# EAGLE design uPlaits_SE_Main_Board (EAGLE 9.6.2)

## Sheet 1 of 4
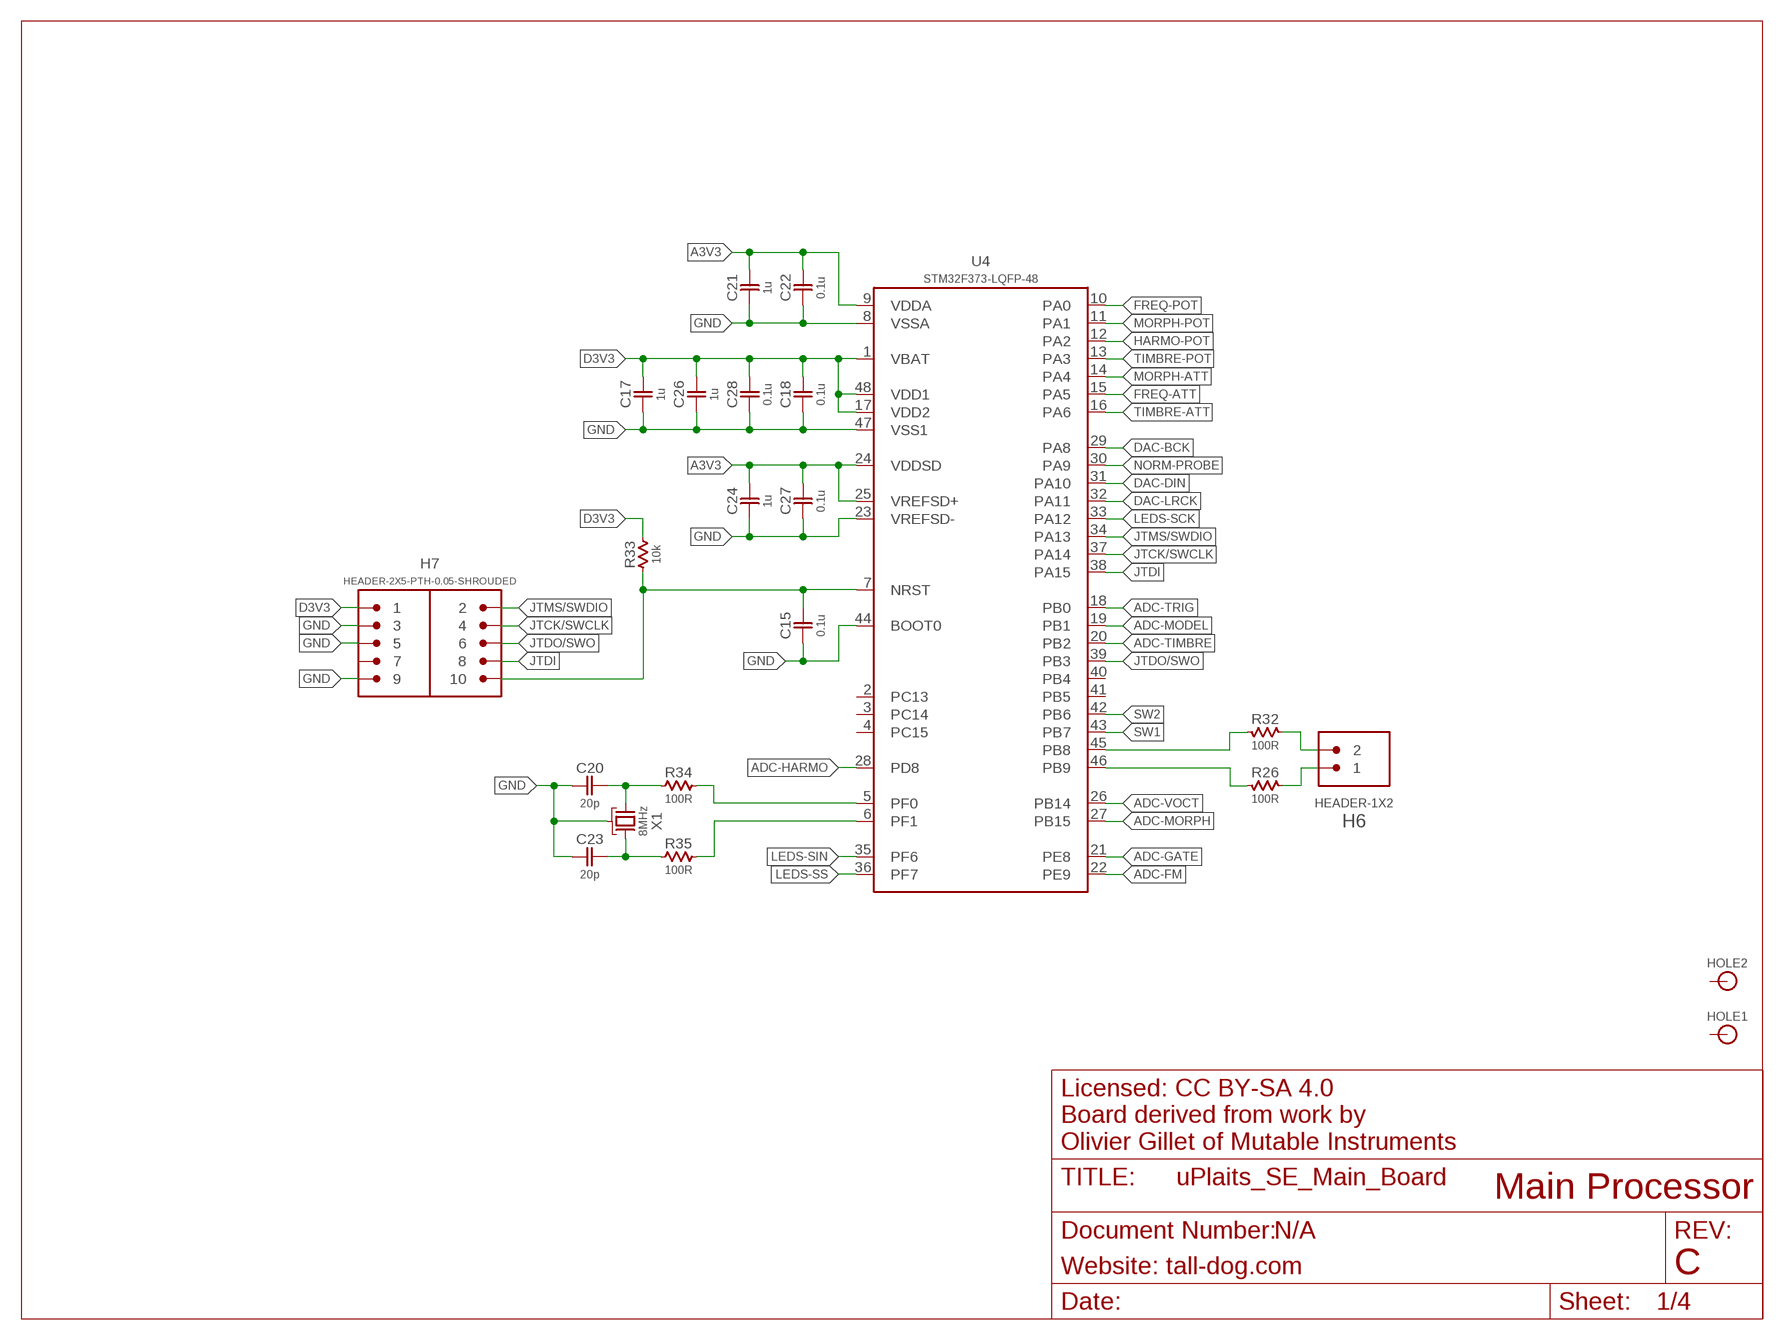
[diagram p0: schematic, sheet 1]

### Parts
C15  0.1u  CAP-NP-0603  [0603-NP]
C17  1u  CAP-NP-0603  [0603-NP]
C18  0.1u  CAP-NP-0603  [0603-NP]
C20  20p  CAP-NP-0603  [0603-NP]
C21  1u  CAP-NP-0603  [0603-NP]
C22  0.1u  CAP-NP-0603  [0603-NP]
C23  20p  CAP-NP-0603  [0603-NP]
C24  1u  CAP-NP-0603  [0603-NP]
C26  1u  CAP-NP-0603  [0603-NP]
C27  0.1u  CAP-NP-0603  [0603-NP]
C28  0.1u  CAP-NP-0603  [0603-NP]
H6  HEADER-1X2  [PTH-0.1-1X2]
H7  HEADER-2X5-PTH-0.05-SHROUDED  [PTH-0.05-2X5-SHROUDED]
HOLE1  HOLE  [HOLE-M2.5]
HOLE2  HOLE  [HOLE-M2.5]
R26  100R  RESISTOR-0603  [0603-NP]
R32  100R  RESISTOR-0603  [0603-NP]
R33  10k  RESISTOR-0603  [0603-NP]
R34  100R  RESISTOR-0603  [0603-NP]
R35  100R  RESISTOR-0603  [0603-NP]
U4  STM32F373-LQFP-48  [LQFP-48]
X1  8MHz  CRYSTAL-GND-ABMM2  [CRYSTAL-ABMM2]

### Nets
A3V3: C21.2 C22.2 C24.2 C27.2 U4.9(VDDA) U4.24(VDDSD) U4.25(VREFSD+) ; also sheet 2,3,4
ADC-FM: U4.22(PE9) ; also sheet 3
ADC-GATE: U4.21(PE8) ; also sheet 3
ADC-HARMO: U4.28(PD8) ; also sheet 3
ADC-MODEL: U4.19(PB1) ; also sheet 3
ADC-MORPH: U4.27(PB15) ; also sheet 3
ADC-TIMBRE: U4.20(PB2) ; also sheet 3
ADC-TRIG: U4.18(PB0) ; also sheet 3
ADC-VOCT: U4.26(PB14) ; also sheet 3
D3V3: C17.2 C18.2 C26.2 C28.2 H7.1 R33.2 U4.1(VBAT) U4.17(VDD2) U4.48(VDD1) ; also sheet 2,3,4
DAC-BCK: U4.29(PA8) ; also sheet 4
DAC-DIN: U4.31(PA10) ; also sheet 4
DAC-LRCK: U4.32(PA11) ; also sheet 4
FREQ-ATT: U4.15(PA5) ; also sheet 2
FREQ-POT: U4.10(PA0) ; also sheet 2
GND: C15.1 C17.1 C18.1 C20.1 C21.1 C22.1 C23.1 C24.1 C26.1 C27.1 C28.1 H7.3 H7.5 H7.9 U4.8(VSSA) U4.23(VREFSD-) U4.44(BOOT0) U4.47(VSS1) X1.2(G) X1.4(G) ; also sheet 2,3,4
HARMO-POT: U4.12(PA2) ; also sheet 2
JTCK/SWCLK: H7.4 U4.37(PA14)
JTDI: H7.8 U4.38(PA15)
JTDO/SWO: H7.6 U4.39(PB3)
JTMS/SWDIO: H7.2 U4.34(PA13)
LEDS-SCK: U4.33(PA12) ; also sheet 2
LEDS-SIN: U4.35(PF6) ; also sheet 2
LEDS-SS: U4.36(PF7) ; also sheet 2
MORPH-ATT: U4.14(PA4) ; also sheet 2
MORPH-POT: U4.11(PA1) ; also sheet 2
N$1: C20.2 R34.1 X1.3
N$2: C23.2 R35.1 X1.1
N$16: R34.2 U4.5(PF0)
N$17: R35.2 U4.6(PF1)
NORM-PROBE: U4.30(PA9) ; also sheet 3
RESET: C15.2 H7.10 R33.1 U4.7(NRST)
RX: H6.1 R26.1
RX1: R26.2 U4.46(PB9)
SW1: U4.43(PB7) ; also sheet 2
SW2: U4.42(PB6) ; also sheet 2
TIMBRE-ATT: U4.16(PA6) ; also sheet 2
TIMBRE-POT: U4.13(PA3) ; also sheet 2
TX: H6.2 R32.1
TX1: R32.2 U4.45(PB8)
Unconnected: H7.7 HOLE1.P$1 HOLE1.P$2 HOLE1.P$3 HOLE1.P$4 HOLE1.P$5 HOLE1.P$6 HOLE1.P$7 HOLE1.P$8 HOLE1.P$9 HOLE2.P$1 HOLE2.P$2 HOLE2.P$3 HOLE2.P$4 HOLE2.P$5 HOLE2.P$6 HOLE2.P$7 HOLE2.P$8 HOLE2.P$9 U4.2(PC13) U4.3(PC14) U4.4(PC15) U4.40(PB4) U4.41(PB5)

### Notes on the sheet
- Licensed: CC BY-SA 4.0
  Board derived from work by
  Olivier Gillet of Mutable Instruments
- Main Processor
- N/A
- Website: tall-dog.com | C

## Sheet 2 of 4
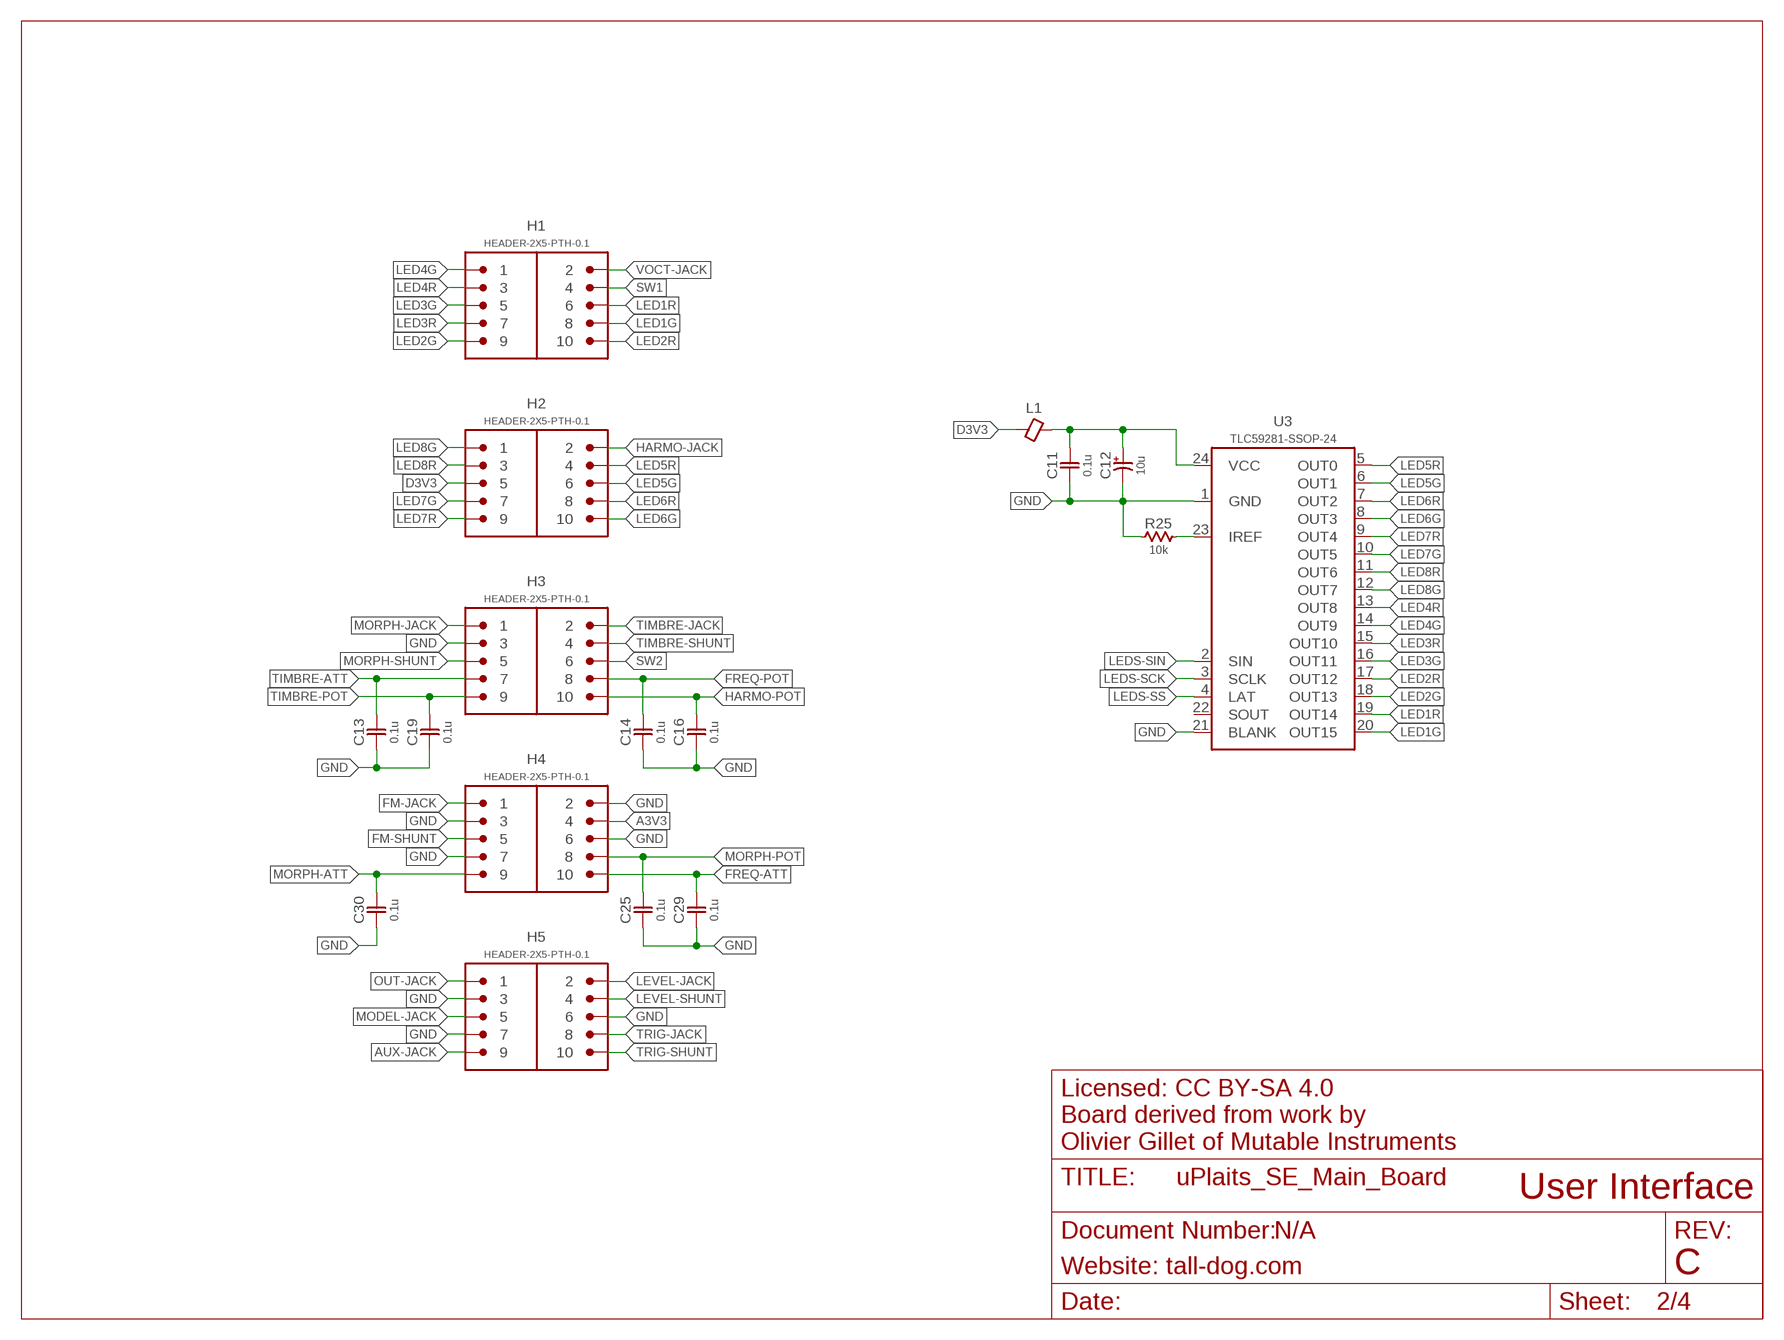
[diagram p1: schematic, sheet 2]

### Parts
C11  0.1u  CAP-NP-0603  [0603-NP]
C12  10u  CAP-P-4.3MM  [ELECTRO-SMD-4.3MM]
C13  0.1u  CAP-NP-0603  [0603-NP]
C14  0.1u  CAP-NP-0603  [0603-NP]
C16  0.1u  CAP-NP-0603  [0603-NP]
C19  0.1u  CAP-NP-0603  [0603-NP]
C25  0.1u  CAP-NP-0603  [0603-NP]
C29  0.1u  CAP-NP-0603  [0603-NP]
C30  0.1u  CAP-NP-0603  [0603-NP]
H1  HEADER-2X5-PTH-0.1  [PTH-0.1-2X5]
H2  HEADER-2X5-PTH-0.1  [PTH-0.1-2X5]
H3  HEADER-2X5-PTH-0.1  [PTH-0.1-2X5]
H4  HEADER-2X5-PTH-0.1  [PTH-0.1-2X5]
H5  HEADER-2X5-PTH-0.1  [PTH-0.1-2X5]
L1  FERRITE-BEAD-0603  [0603-NP]
R25  10k  RESISTOR-0603  [0603-NP]
U3  TLC59281-SSOP-24  [SSOP-24]

### Nets
A3V3: H4.4 ; also sheet 1,3,4
AUX-JACK: H5.9 ; also sheet 4
D3V3: H2.5 L1.1 ; also sheet 1,3,4
FM-JACK: H4.1 ; also sheet 3
FM-SHUNT: H4.5 ; also sheet 3
FREQ-ATT: C29.2 H4.10 ; also sheet 1
FREQ-POT: C14.2 H3.8 ; also sheet 1
GND: C11.1 C12.C(NEG) C13.1 C14.1 C16.1 C19.1 C25.1 C29.1 C30.1 H3.3 H4.2 H4.3 H4.6 H4.7 H5.3 H5.6 H5.7 R25.1 U3.1(GND) U3.21(BLANK) ; also sheet 1,3,4
HARMO-JACK: H2.2 ; also sheet 3
HARMO-POT: C16.2 H3.10 ; also sheet 1
IREF: R25.2 U3.23(IREF)
LED1G: H1.8 U3.20(OUT15)
LED1R: H1.6 U3.19(OUT14)
LED2G: H1.9 U3.18(OUT13)
LED2R: H1.10 U3.17(OUT12)
LED3G: H1.5 U3.16(OUT11)
LED3R: H1.7 U3.15(OUT10)
LED4G: H1.1 U3.14(OUT9)
LED4R: H1.3 U3.13(OUT8)
LED5G: H2.6 U3.6(OUT1)
LED5R: H2.4 U3.5(OUT0)
LED6G: H2.10 U3.8(OUT3)
LED6R: H2.8 U3.7(OUT2)
LED7G: H2.7 U3.10(OUT5)
LED7R: H2.9 U3.9(OUT4)
LED8G: H2.1 U3.12(OUT7)
LED8R: H2.3 U3.11(OUT6)
LEDS-SCK: U3.3(SCLK) ; also sheet 1
LEDS-SIN: U3.2(SIN) ; also sheet 1
LEDS-SS: U3.4(LAT) ; also sheet 1
LEVEL-JACK: H5.2 ; also sheet 3
LEVEL-SHUNT: H5.4 ; also sheet 3
MODEL-JACK: H5.5 ; also sheet 3
MORPH-ATT: C30.2 H4.9 ; also sheet 1
MORPH-JACK: H3.1 ; also sheet 3
MORPH-POT: C25.2 H4.8 ; also sheet 1
MORPH-SHUNT: H3.5 ; also sheet 3
N$30: C11.2 C12.A(POS) L1.2 U3.24(VCC)
OUT-JACK: H5.1 ; also sheet 4
SW1: H1.4 ; also sheet 1
SW2: H3.6 ; also sheet 1
TIMBRE-ATT: C13.2 H3.7 ; also sheet 1
TIMBRE-JACK: H3.2 ; also sheet 3
TIMBRE-POT: C19.2 H3.9 ; also sheet 1
TIMBRE-SHUNT: H3.4 ; also sheet 3
TRIG-JACK: H5.8 ; also sheet 3
TRIG-SHUNT: H5.10 ; also sheet 3
VOCT-JACK: H1.2 ; also sheet 3
Unconnected: U3.22(SOUT)

### Notes on the sheet
- Licensed: CC BY-SA 4.0
  Board derived from work by
  Olivier Gillet of Mutable Instruments
- User Interface
- N/A
- Website: tall-dog.com | C

## Sheet 3 of 4
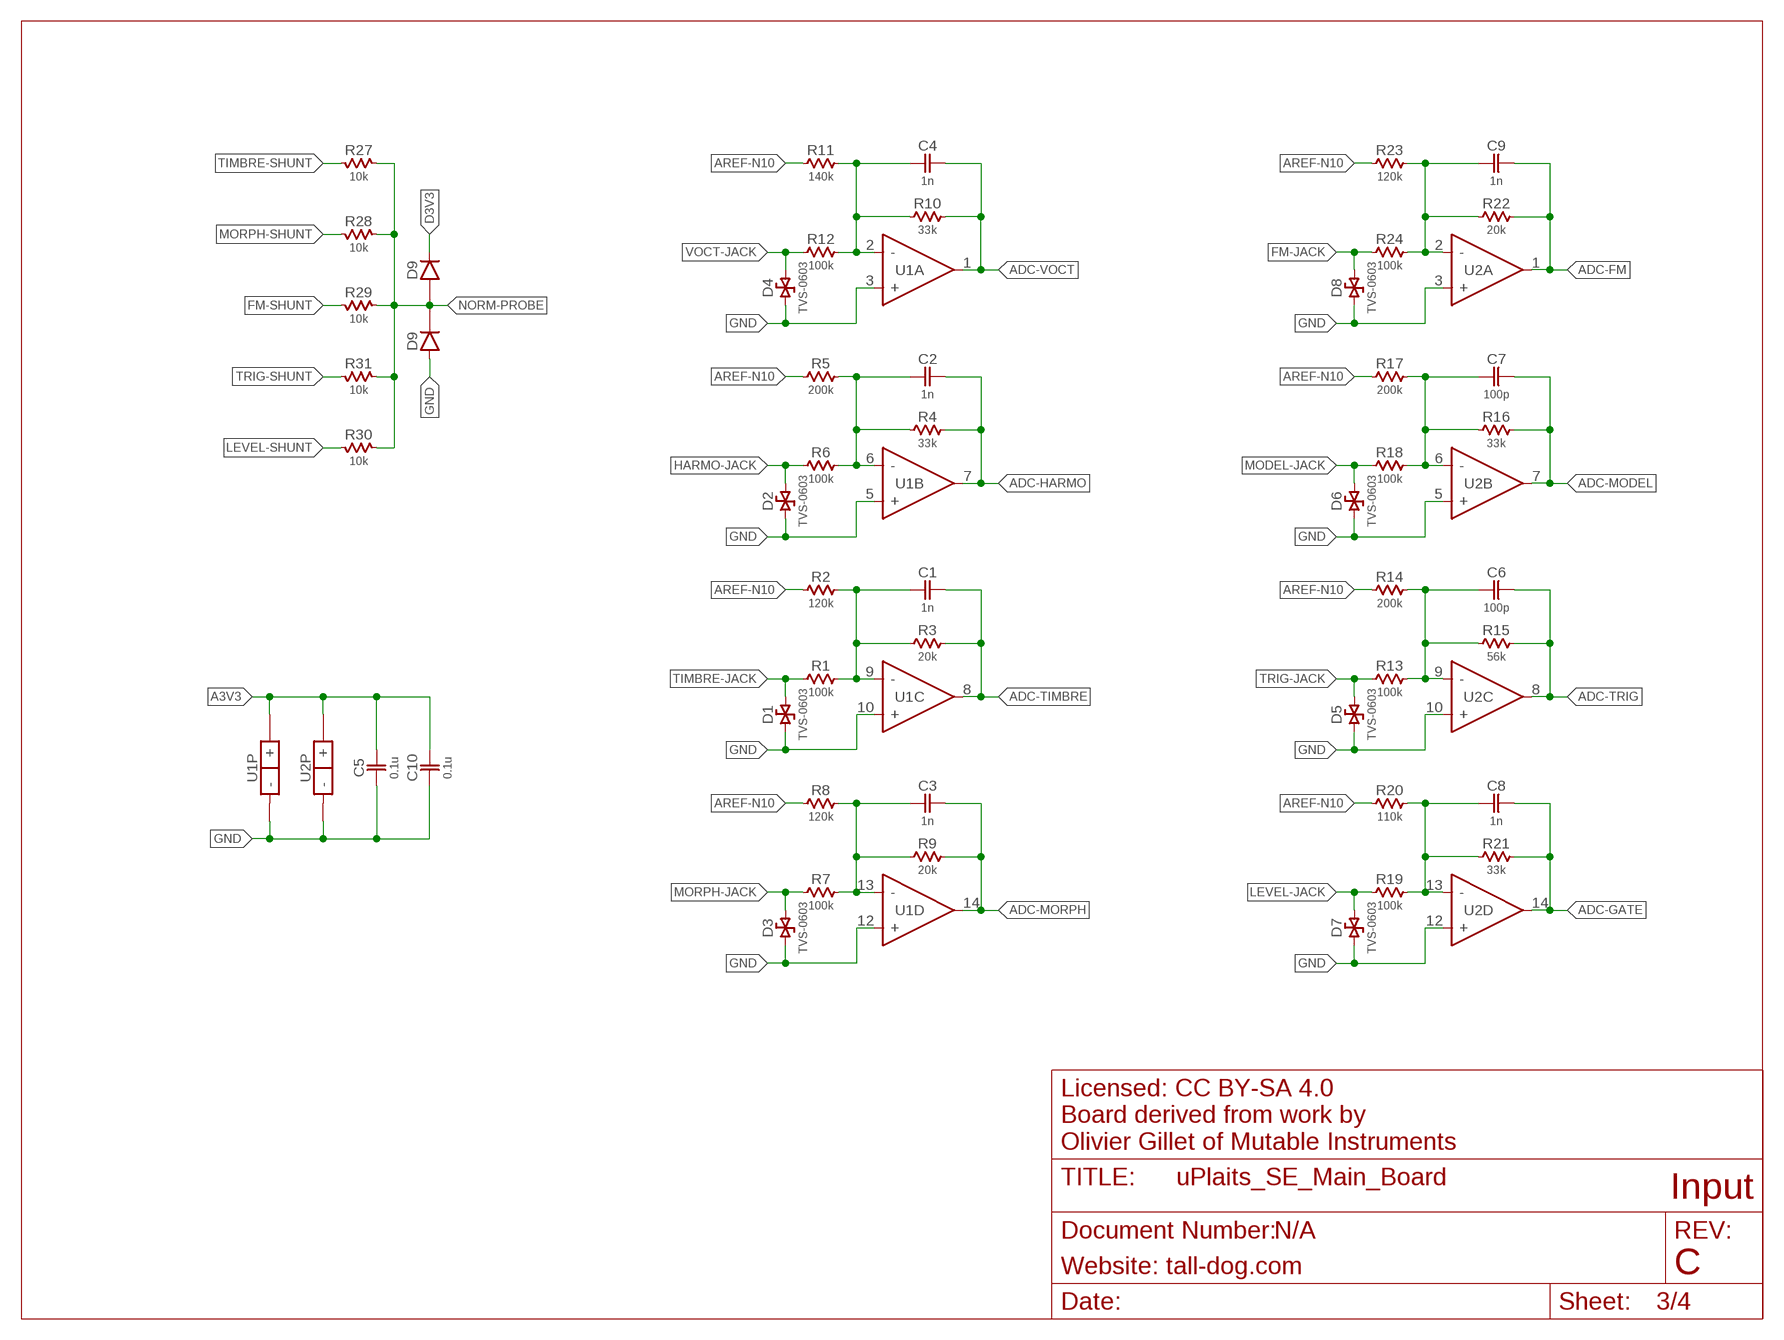
[diagram p2: schematic, sheet 3]

### Parts
C1  1n  CAP-NP-0603  [0603-NP]
C2  1n  CAP-NP-0603  [0603-NP]
C3  1n  CAP-NP-0603  [0603-NP]
C4  1n  CAP-NP-0603  [0603-NP]
C5  0.1u  CAP-NP-0603  [0603-NP]
C6  100p  CAP-NP-0603  [0603-NP]
C7  100p  CAP-NP-0603  [0603-NP]
C8  1n  CAP-NP-0603  [0603-NP]
C9  1n  CAP-NP-0603  [0603-NP]
C10  0.1u  CAP-NP-0603  [0603-NP]
D1  TVS-0603  [0603-NP]
D2  TVS-0603  [0603-NP]
D3  TVS-0603  [0603-NP]
D4  TVS-0603  [0603-NP]
D5  TVS-0603  [0603-NP]
D6  TVS-0603  [0603-NP]
D7  TVS-0603  [0603-NP]
D8  TVS-0603  [0603-NP]
D9  DIODE-DUAL-SOT-23  [SOT-23-3]
R1  100k  RESISTOR-0603  [0603-NP]
R2  120k  RESISTOR-0603  [0603-NP]
R3  20k  RESISTOR-0603  [0603-NP]
R4  33k  RESISTOR-0603  [0603-NP]
R5  200k  RESISTOR-0603  [0603-NP]
R6  100k  RESISTOR-0603  [0603-NP]
R7  100k  RESISTOR-0603  [0603-NP]
R8  120k  RESISTOR-0603  [0603-NP]
R9  20k  RESISTOR-0603  [0603-NP]
R10  33k  RESISTOR-0603  [0603-NP]
R11  140k  RESISTOR-0603  [0603-NP]
R12  100k  RESISTOR-0603  [0603-NP]
R13  100k  RESISTOR-0603  [0603-NP]
R14  200k  RESISTOR-0603  [0603-NP]
R15  56k  RESISTOR-0603  [0603-NP]
R16  33k  RESISTOR-0603  [0603-NP]
R17  200k  RESISTOR-0603  [0603-NP]
R18  100k  RESISTOR-0603  [0603-NP]
R19  100k  RESISTOR-0603  [0603-NP]
R20  110k  RESISTOR-0603  [0603-NP]
R21  33k  RESISTOR-0603  [0603-NP]
R22  20k  RESISTOR-0603  [0603-NP]
R23  120k  RESISTOR-0603  [0603-NP]
R24  100k  RESISTOR-0603  [0603-NP]
R27  10k  RESISTOR-0603  [0603-NP]
R28  10k  RESISTOR-0603  [0603-NP]
R29  10k  RESISTOR-0603  [0603-NP]
R30  10k  RESISTOR-0603  [0603-NP]
R31  10k  RESISTOR-0603  [0603-NP]
U1  MCP6004-TSSOP-14  [TSSOP-14]
U2  MCP6004-TSSOP-14  [TSSOP-14]

### Nets
A3V3: C5.2 C10.2 U1.4(P:+) U2.4(P:+) ; also sheet 1,2,4
ADC-FM: C9.2 R22.2 U2.1(A:OUT) ; also sheet 1
ADC-GATE: C8.2 R21.2 U2.14(D:OUT) ; also sheet 1
ADC-HARMO: C2.2 R4.2 U1.7(B:OUT) ; also sheet 1
ADC-MODEL: C7.2 R16.2 U2.7(B:OUT) ; also sheet 1
ADC-MORPH: C3.2 R9.2 U1.14(D:OUT) ; also sheet 1
ADC-TIMBRE: C1.2 R3.2 U1.8(C:OUT) ; also sheet 1
ADC-TRIG: C6.2 R15.2 U2.8(C:OUT) ; also sheet 1
ADC-VOCT: C4.2 R10.2 U1.1(A:OUT) ; also sheet 1
AREF-N10: R2.1 R5.1 R8.1 R11.1 R14.1 R17.1 R20.1 R23.1 ; also sheet 4
D3V3: D9.2(C2) ; also sheet 1,2,4
FM-JACK: D8.2 R24.1 ; also sheet 2
FM-SHUNT: R29.2 ; also sheet 2
GND: C5.1 C10.1 D1.1 D2.1 D3.1 D4.1 D5.1 D6.1 D7.1 D8.1 D9.1(A1) U1.3(A:+) U1.5(B:+) U1.10(C:+) U1.11(P:-) U1.12(D:+) U2.3(A:+) U2.5(B:+) U2.10(C:+) U2.11(P:-) U2.12(D:+) ; also sheet 1,2,4
HARMO-JACK: D2.2 R6.1 ; also sheet 2
LEVEL-JACK: D7.2 R19.1 ; also sheet 2
LEVEL-SHUNT: R30.2 ; also sheet 2
MODEL-JACK: D6.2 R18.1 ; also sheet 2
MORPH-JACK: D3.2 R7.1 ; also sheet 2
MORPH-SHUNT: R28.2 ; also sheet 2
N$24: C4.1 R10.1 R11.2 R12.2 U1.2(A:-)
N$26: C2.1 R4.1 R5.2 R6.2 U1.6(B:-)
N$31: C9.1 R22.1 R23.2 R24.2 U2.2(A:-)
N$32: C1.1 R1.2 R2.2 R3.1 U1.9(C:-)
N$33: C3.1 R7.2 R8.2 R9.1 U1.13(D:-)
N$37: C7.1 R16.1 R17.2 R18.2 U2.6(B:-)
N$43: C6.1 R13.2 R14.2 R15.1 U2.9(C:-)
N$45: C8.1 R19.2 R20.2 R21.1 U2.13(D:-)
NORM-PROBE: D9.3(C1/A2) R27.1 R28.1 R29.1 R30.1 R31.1 ; also sheet 1
TIMBRE-JACK: D1.2 R1.1 ; also sheet 2
TIMBRE-SHUNT: R27.2 ; also sheet 2
TRIG-JACK: D5.2 R13.1 ; also sheet 2
TRIG-SHUNT: R31.2 ; also sheet 2
VOCT-JACK: D4.2 R12.1 ; also sheet 2

### Notes on the sheet
- Licensed: CC BY-SA 4.0
  Board derived from work by
  Olivier Gillet of Mutable Instruments
- Input
- N/A
- Website: tall-dog.com | C

## Sheet 4 of 4
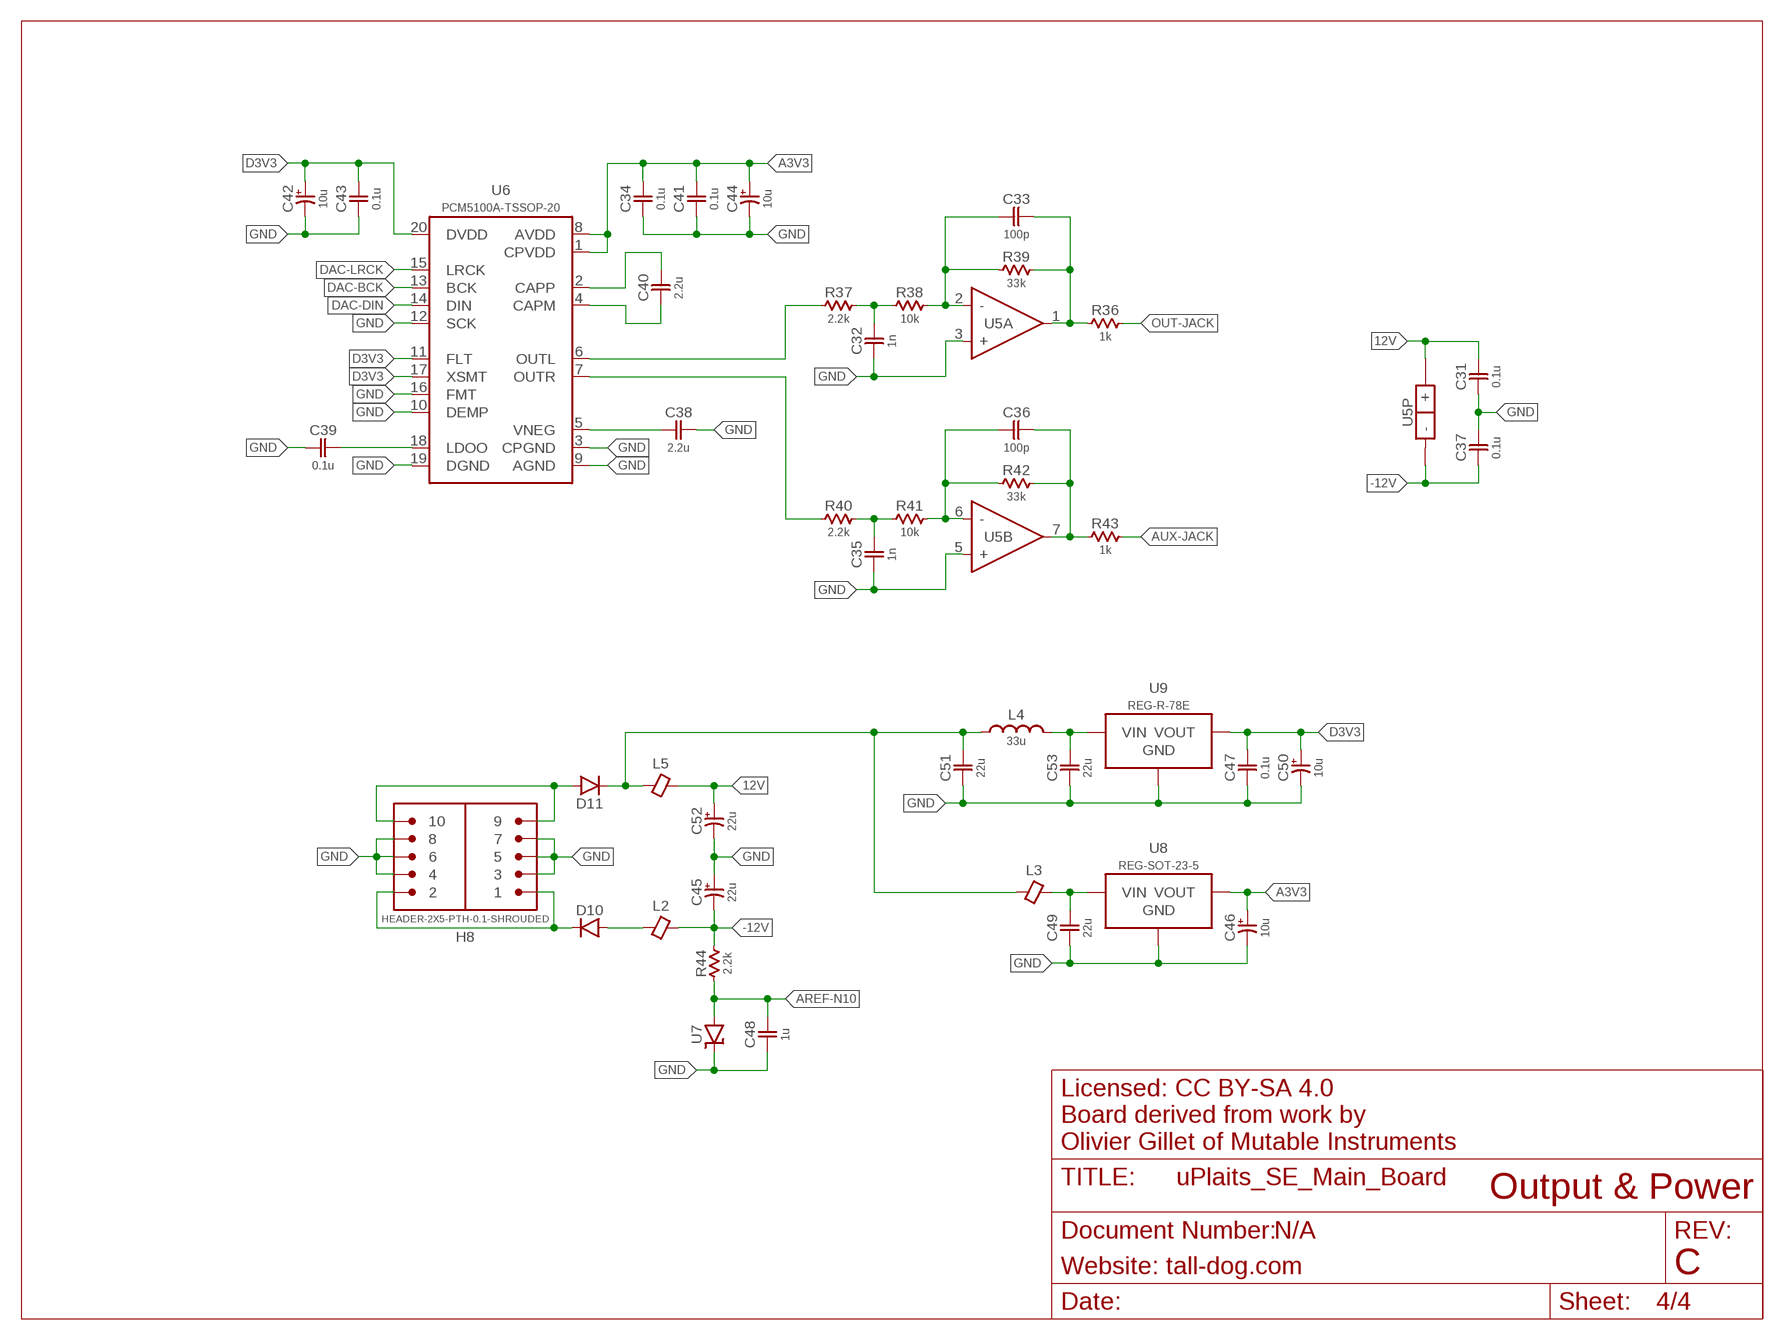
[diagram p3: schematic, sheet 4]

### Parts
C31  0.1u  CAP-NP-0603  [0603-NP]
C32  1n  CAP-NP-0603  [0603-NP]
C33  100p  CAP-NP-0603  [0603-NP]
C34  0.1u  CAP-NP-0603  [0603-NP]
C35  1n  CAP-NP-0603  [0603-NP]
C36  100p  CAP-NP-0603  [0603-NP]
C37  0.1u  CAP-NP-0603  [0603-NP]
C38  2.2u  CAP-NP-0805  [0805-NP]
C39  0.1u  CAP-NP-0603  [0603-NP]
C40  2.2u  CAP-NP-0805  [0805-NP]
C41  0.1u  CAP-NP-0603  [0603-NP]
C42  10u  CAP-P-4.3MM  [ELECTRO-SMD-4.3MM]
C43  0.1u  CAP-NP-0603  [0603-NP]
C44  10u  CAP-P-4.3MM  [ELECTRO-SMD-4.3MM]
C45  22u  CAP-P-6.6MM  [ELECTRO-SMD-6.6MM]
C46  10u  CAP-P-4.3MM  [ELECTRO-SMD-4.3MM]
C47  0.1u  CAP-NP-0603  [0603-NP]
C48  1u  CAP-NP-0603  [0603-NP]
C49  22u  CAP-NP-1206  [1206-NP]
C50  10u  CAP-P-4.3MM  [ELECTRO-SMD-4.3MM]
C51  22u  CAP-NP-1206  [1206-NP]
C52  22u  CAP-P-6.6MM  [ELECTRO-SMD-6.6MM]
C53  22u  CAP-NP-1206  [1206-NP]
D10  DIODE-SOD123  [SOD-123]
D11  DIODE-SOD123  [SOD-123]
H8  HEADER-2X5-PTH-0.1-SHROUDED  [PTH-0.1-2X5-SHROUDED]
L2  FERRITE-BEAD-0603  [0603-NP]
L3  FERRITE-BEAD-0603  [0603-NP]
L4  33u  INDUCTOR-0805  [0805-NP]
L5  FERRITE-BEAD-0603  [0603-NP]
R36  1k  RESISTOR-0603  [0603-NP]
R37  2.2k  RESISTOR-0603  [0603-NP]
R38  10k  RESISTOR-0603  [0603-NP]
R39  33k  RESISTOR-0603  [0603-NP]
R40  2.2k  RESISTOR-0603  [0603-NP]
R41  10k  RESISTOR-0603  [0603-NP]
R42  33k  RESISTOR-0603  [0603-NP]
R43  1k  RESISTOR-0603  [0603-NP]
R44  2.2k  RESISTOR-0603  [0603-NP]
U5  TL072-SO-8  [SO-8]
U6  PCM5100A-TSSOP-20  [TSSOP-20]
U7  LM4040-SOT-23  [SOT-23-3]
U8  REG-SOT-23-5  [SOT-23-5]
U9  REG-R-78E  [R-78E]

### Nets
12V: C31.2 C52.A(POS) L5.2 U5.8(P:+)
12V-IN: D11.A H8.9 H8.10
-12V: C37.1 C45.C(NEG) L2.2 R44.2 U5.4(P:-)
-12V-IN: D10.C H8.1 H8.2
A3V3: C34.2 C41.2 C44.A(POS) C46.A(POS) U6.1(CPVDD) U6.8(AVDD) U8.5(VOUT) ; also sheet 1,2,3
AREF-N10: C48.2 R44.1 U7.2(A) ; also sheet 3
AUX-JACK: R43.2 ; also sheet 2
D3V3: C42.A(POS) C43.2 C47.2 C50.A(POS) U6.11(FLT) U6.17(XSMT) U6.20(DVDD) U9.3(VOUT) ; also sheet 1,2,3
DAC-BCK: U6.13(BCK) ; also sheet 1
DAC-DIN: U6.14(DIN) ; also sheet 1
DAC-LRCK: U6.15(LRCK) ; also sheet 1
GND: C31.1 C32.1 C34.1 C35.1 C37.2 C38.2 C39.1 C41.1 C42.C(NEG) C43.1 C44.C(NEG) C45.A(POS) C46.C(NEG) C47.1 C48.1 C49.1 C50.C(NEG) C51.1 C52.C(NEG) C53.1 H8.3 H8.4 H8.5 H8.6 H8.7 H8.8 U5.3(A:+) U5.5(B:+) U6.3(CPGND) U6.9(AGND) U6.10(DEMP) U6.12(SCK) U6.16(FMT) U6.19(DGND) U7.1(C) U8.2(GND) U9.2(GND) ; also sheet 1,2,3
N$42: C32.2 R37.2 R38.1
N$44: C35.2 R40.2 R41.1
N$47: C33.1 R38.2 R39.1 U5.2(A:-)
N$48: C36.1 R41.2 R42.1 U5.6(B:-)
N$51: C40.2 U6.2(CAPP)
N$52: C40.1 U6.4(CAPM)
N$53: R37.1 U6.6(OUTL)
N$54: R40.1 U6.7(OUTR)
N$55: C38.1 U6.5(VNEG)
N$56: D10.A L2.1
N$57: C51.2 D11.C L3.1 L4.1 L5.1
N$58: C36.2 R42.2 R43.1 U5.7(B:OUT)
N$59: C33.2 R36.1 R39.2 U5.1(A:OUT)
N$61: C53.2 L4.2 U9.1(VIN)
N$62: C49.2 L3.2 U8.1(VIN) U8.3(VIN)
N$63: C39.2 U6.18(LDOO)
OUT-JACK: R36.2 ; also sheet 2

### Notes on the sheet
- Licensed: CC BY-SA 4.0
  Board derived from work by
  Olivier Gillet of Mutable Instruments
- Output & Power
- N/A
- Website: tall-dog.com | C

## Library data of the parts
C1-C11 C13-C41 C43 C47-C49 C51 C53 = uPlaits_SE_Library:CAP-NP
C12 C42 C44-C46 C50 C52 = uPlaits_SE_Library:CAP-P
D1-D8 = uPlaits_SE_Library:TVS
D9 = uPlaits_SE_Library:DIODE-DUAL
D10 D11 = uPlaits_SE_Library:DIODE
H1-H5 H7 H8 = uPlaits_SE_Library:HEADER-2X5
H6 = uPlaits_SE_Library:HEADER-1X2
HOLE1 HOLE2 = uPlaits_SE_Library:HOLE
L1-L3 L5 = uPlaits_SE_Library:FERRITE-BEAD
L4 = uPlaits_SE_Library:INDUCTOR
R1-R44 = uPlaits_SE_Library:RESISTOR
U1 U2 = uPlaits_SE_Library:MCP6004
U3 = uPlaits_SE_Library:TLC59281
U4 = uPlaits_SE_Library:STM32F373
U5 = uPlaits_SE_Library:TL072
U6 = uPlaits_SE_Library:PCM5100A
U7 = uPlaits_SE_Library:LM4040
U8 U9 = uPlaits_SE_Library:REG
X1 = uPlaits_SE_Library:CRYSTAL-GND

## Board
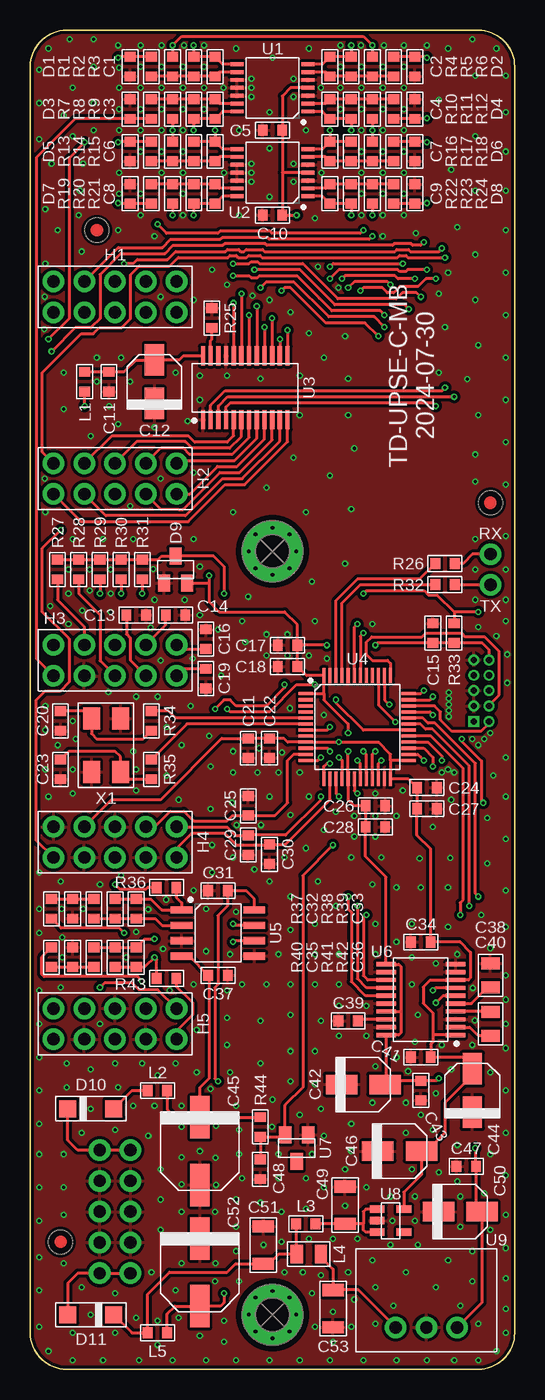
[diagram p4: board, top side]
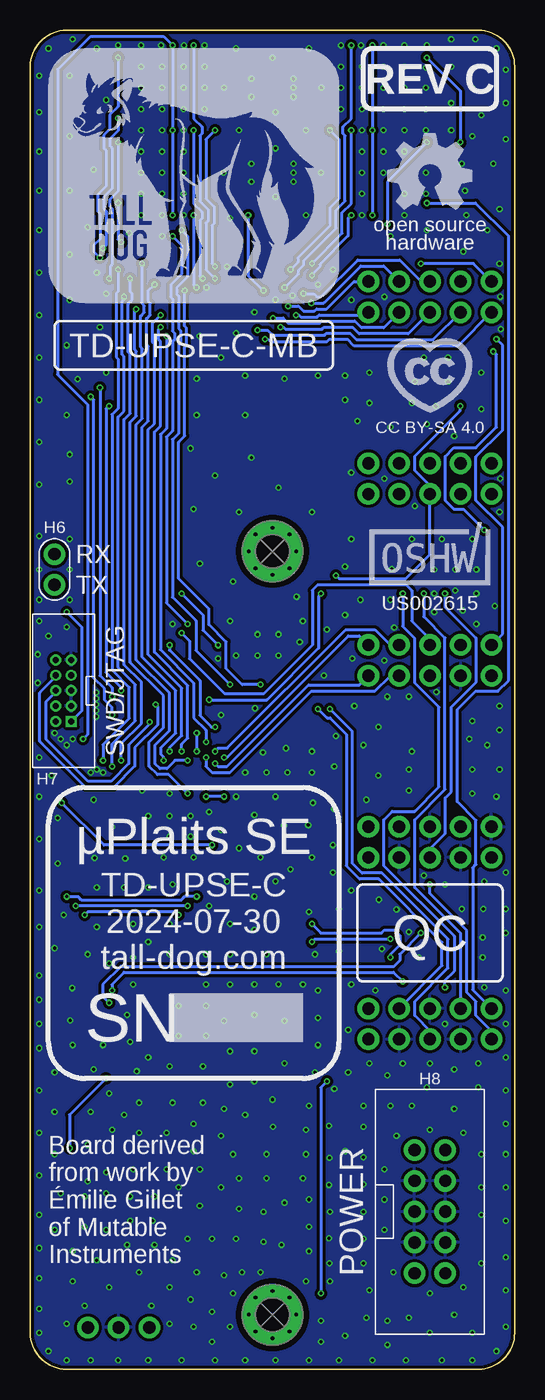
[diagram p5: board, bottom side, seen from below]

Size 40 x 110.5 mm. Coordinates in mm from the lower left corner, seen from the top.
Outline: 3,0 37,0 arc90 40,3 40,107.5 arc90 37,110.5 3,110.5 arc90 0,107.5 0,3 arc90 3,0
Copper layers (1*16): Top 0.035mm / dielectric 1.5mm / Bottom 0.035mm
Design rules "default *": minimum track width 0.25mm, minimum drill 0.25mm, track to track 0.25mm, track to pad 0.25mm, pad to pad 0.25mm, via to via 0.25mm, smd to smd 0.25mm, copper to edge 0.25mm, drill to drill 0.25mm, minimum pad ring 5mil, minimum via ring 5mil, stop-mask expansion 0mil, vias tented up to drill 0.35mm, thermal gap 0.25mm

### Footprints (pad centres in the part's own frame; a part is rotated, then mirrored left to right if it is on the bottom)
0603-NP = smd 0.81 x 0.93: 1 -0.81,0; 2 0.81,0
ELECTRO-SMD-4.3MM = smd 2.6 x 1.6: A 1.8,0; C -1.8,0
0805-NP = smd 1 x 1.5: 1 -1,0; 2 1,0
ELECTRO-SMD-6.6MM = smd 3.5 x 1.6: A 2.8,0; C -2.8,0
1206-NP = smd 1 x 1.77: 1 -1.535,0; 2 1.535,0
SOT-23-3 = smd 1 x 1.4: 1 -0.95,-1.1; 2 0.95,-1.1; 3 0,1.1
SOD-123 = smd 1.4 x 1.4: A 1.9,0; C -1.9,0
PTH-0.1-2X5 = drill 1.016 pad 1.778: 1 -5.08,-1.27; 2 -5.08,1.27; 3 -2.54,-1.27; 4 -2.54,1.27; 5 0,-1.27; 6 0,1.27; 7 2.54,-1.27; 8 2.54,1.27; 9 5.08,-1.27; 10 5.08,1.27
PTH-0.1-1X2 = drill 1.016 pad 1.778: 1 -1.27,0; 2 1.27,0
PTH-0.05-2X5-SHROUDED = drill 0.5 pad 0.9 square: 1 -0.635,2.54 | drill 0.5 pad 0.9: 2 0.635,2.54; 3 -0.635,1.27; 4 0.635,1.27; 5 -0.635,0; 6 0.635,0; 7 -0.635,-1.27; 8 0.635,-1.27; 9 -0.635,-2.54; 10 0.635,-2.54
PTH-0.1-2X5-SHROUDED = drill 1.016 pad 1.778: 1 -1.27,5.08; 2 1.27,5.08; 3 -1.27,2.54; 4 1.27,2.54; 5 -1.27,0; 6 1.27,0; 7 -1.27,-2.54; 8 1.27,-2.54; 9 -1.27,-5.08; 10 1.27,-5.08
HOLE-M2.5 = drill 2.75 pad 5: P$1 0,0 | drill 0.3: P$2 0,1.95; P$3 0,-1.95; P$4 -1.95,0; P$5 1.95,0; P$6 1.4,1.4; P$7 -1.4,1.4; P$8 -1.4,-1.4; P$9 1.4,-1.4
TSSOP-14 = smd 0.32 x 1.05: 1 -1.95,-2.925; 2 -1.3,-2.925; 3 -0.65,-2.925; 4 0,-2.925; 5 0.65,-2.925; 6 1.3,-2.925; 7 1.95,-2.925; 8 1.95,2.925; 9 1.3,2.925; 10 0.65,2.925; 11 0,2.925; 12 -0.65,2.925; 13 -1.3,2.925; 14 -1.95,2.925
SSOP-24 = smd 1.6 x 0.35: 1 -2.629,3.493; 2 -2.629,2.857; 3 -2.629,2.223; 4 -2.629,1.587; 5 -2.629,0.953; 6 -2.629,0.318; 7 -2.629,-0.318; 8 -2.629,-0.953; 9 -2.629,-1.587; 10 -2.629,-2.223; 11 -2.629,-2.857; 12 -2.629,-3.493; 13 2.629,-3.493; 14 2.629,-2.857; 15 2.629,-2.223; 16 2.629,-1.587; 17 2.629,-0.953; 18 2.629,-0.318; 19 2.629,0.318; 20 2.629,0.953; 21 2.629,1.587; 22 2.629,2.223; 23 2.629,2.857; 24 2.629,3.493
LQFP-48 = smd 0.25 x 1.2: 1 -2.75,-4.25; 2 -2.25,-4.25; 3 -1.75,-4.25; 4 -1.25,-4.25; 5 -0.75,-4.25; 6 -0.25,-4.25; 7 0.25,-4.25; 8 0.75,-4.25; 9 1.25,-4.25; 10 1.75,-4.25; 11 2.25,-4.25; 12 2.75,-4.25; 25 2.75,4.25; 26 2.25,4.25; 27 1.75,4.25; 28 1.25,4.25; 29 0.75,4.25; 30 0.25,4.25; 31 -0.25,4.25; 32 -0.75,4.25; 33 -1.25,4.25; 34 -1.75,4.25; 35 -2.25,4.25; 36 -2.75,4.25 | smd 1.2 x 0.25: 13 4.25,-2.75; 14 4.25,-2.25; 15 4.25,-1.75; 16 4.25,-1.25; 17 4.25,-0.75; 18 4.25,-0.25; 19 4.25,0.25; 20 4.25,0.75; 21 4.25,1.25; 22 4.25,1.75; 23 4.25,2.25; 24 4.25,2.75; 37 -4.25,2.75; 38 -4.25,2.25; 39 -4.25,1.75; 40 -4.25,1.25; 41 -4.25,0.75; 42 -4.25,0.25; 43 -4.25,-0.25; 44 -4.25,-0.75; 45 -4.25,-1.25; 46 -4.25,-1.75; 47 -4.25,-2.25; 48 -4.25,-2.75
SO-8 = smd 0.6 x 1.8: 1 -1.905,-3; 2 -0.635,-3; 3 0.635,-3; 4 1.905,-3; 5 1.905,3; 6 0.635,3; 7 -0.635,3; 8 -1.905,3
TSSOP-20 = smd 1.6 x 0.35: 1 -2.872,2.925; 2 -2.872,2.275; 3 -2.872,1.625; 4 -2.872,0.975; 5 -2.872,0.325; 6 -2.872,-0.325; 7 -2.872,-0.975; 8 -2.872,-1.625; 9 -2.872,-2.275; 10 -2.872,-2.925; 11 2.872,-2.925; 12 2.872,-2.275; 13 2.872,-1.625; 14 2.872,-0.975; 15 2.872,-0.325; 16 2.872,0.325; 17 2.872,0.975; 18 2.872,1.625; 19 2.872,2.275; 20 2.872,2.925
SOT-23-5 = smd 0.62 x 1.22: 1 -0.95,-1.1; 2 0,-1.1; 3 0.95,-1.1; 4 0.95,1.1; 5 -0.95,1.1
R-78E = drill 1.016 pad 1.778: 1 -2.54,0; 2 0,0; 3 2.54,0
CRYSTAL-ABMM2 = smd 1.8 x 1.4: 1 -2.2,-1.2; 2 2.2,-1.2; 3 2.2,1.2; 4 -2.2,1.2

### Placement (x,y rotation side)
C1  15.25,107.5 90 top
C2  24.75,107.5 90 top
C3  15.25,104 270 top
C4  24.75,104 270 top
C5  20,102.25 0 top
C6  15.25,100.5 90 top
C7  24.75,100.5 90 top
C8  15.25,97 270 top
C9  24.75,97 270 top
C10  20,95.25 0 top
C11  6.5,81.5 90 top
C12  10.25,81.5 90 top
C13  8.75,62.25 180 top
C14  12,62.25 180 top
C15  33.25,60.75 270 top
C16  14.5,60.25 270 top
C17  21.25,59.75 0 top
C18  21.25,58 0 top
C19  14.5,57 90 top
C20  2.5,53.5 90 top
C21  18,51.25 90 top
C22  19.75,51.25 90 top
C23  2.5,49.5 90 top
C24  32.75,48 180 top
C25  18,46.5 270 top
C26  28.5,46.5 180 top
C27  32.75,46.25 180 top
C28  28.5,44.75 180 top
C29  18,43.25 90 top
C30  19.75,42.5 90 top
C31  15.5,39.5 0 top
C32  3.5,38 90 top
C33  8.75,38 90 top
C34  32.25,35.25 0 top
C35  3.5,34 270 top
C36  8.75,34 270 top
C37  15.5,32.5 0 top
C38  38,32.5 90 top
C39  26.25,28.75 0 top
C40  38,28.5 270 top
C41  32.25,25.75 0 top
C42  27.5,23.5 0 top
C43  32.25,23 90 top
C44  36.5,23 90 top
C45  14,18 270 top
C46  30.5,18 0 top
C47  36,16.75 0 top
C48  19,16.5 90 top
C49  26,13.54 270 top
C50  35.5,13 0 top
C51  19.25,10.25 270 top
C52  14,8 270 top
C53  25,5 90 top
D1  8.25,107.5 90 top
D2  31.75,107.5 90 top
D3  8.25,104 270 top
D4  31.75,104 270 top
D5  8.25,100.5 90 top
D6  31.75,100.5 90 top
D7  8.25,97 270 top
D8  31.75,97 270 top
D9  12,66 0 top
D10  5,21.5 0 top
D11  5,4.5 180 top
H1  7,88.5 0 top
H2  7,73.5 0 top
H3  7,58.5 0 top
H4  7,43.5 0 top
H5  7,28.5 0 top
H6  38,66 270 bottom
H7  37.25,56 180 bottom
H8  7,13 0 bottom
HOLE1  20,67.5 0 top
HOLE2  20,4.5 0 top
L1  4.5,81.5 90 top
L2  10.5,23 0 top
L3  22.75,12 0 top
L4  23,9.5 0 top
L5  10.5,3 0 top
R1  10,107.5 270 top
R2  11.75,107.5 270 top
R3  13.5,107.5 90 top
R4  26.5,107.5 90 top
R5  28.25,107.5 270 top
R6  30,107.5 270 top
R7  10,104 90 top
R8  11.75,104 90 top
R9  13.5,104 270 top
R10  26.5,104 270 top
R11  28.25,104 90 top
R12  30,104 90 top
R13  10,100.5 270 top
R14  11.75,100.5 270 top
R15  13.5,100.5 90 top
R16  26.5,100.5 90 top
R17  28.25,100.5 270 top
R18  30,100.5 270 top
R19  10,97 90 top
R20  11.75,97 90 top
R21  13.5,97 270 top
R22  26.5,97 270 top
R23  28.25,97 90 top
R24  30,97 90 top
R25  15,86.75 270 top
R26  34.25,66.5 180 top
R27  2.25,66 270 top
R28  4,66 270 top
R29  5.75,66 270 top
R30  7.5,66 270 top
R31  9.25,66 270 top
R32  34.25,64.75 180 top
R33  35,60.75 90 top
R34  10,53.5 90 top
R35  10,49.5 90 top
R36  11.25,39.75 180 top
R37  1.75,38 90 top
R38  5.25,38 270 top
R39  7,38 90 top
R40  1.75,34 270 top
R41  5.25,34 90 top
R42  7,34 270 top
R43  11.25,32.25 0 top
R44  19,20 90 top
U1  20,105.75 90 top
U2  20,98.75 90 top
U3  17.75,81 90 top
U4  27,53 270 top
U5  15.5,36 270 top
U6  32.25,30.5 180 top
U7  22,18.25 180 top
U8  29.75,12.25 270 top
U9  32.71,3.45 0 top
U$1  [LOGO-TD]  26.5,98.5 0 bottom
U$6  [FIDUCIAL]  5.5,94 0 top
U$7  [FIDUCIAL]  38,71.5 0 top
U$8  [FIDUCIAL]  2.5,10.5 0 top
U$9  [LOGO-CC]  7,82 0 bottom
U$10  [LOGO-OSH]  7,98.5 0 bottom
U$11  [LOGO-OSHW]  7,67 0 bottom
U$12  [LOGO-PN]  26.5,84.5 0 bottom
U$13  [LOGO-QC]  7,36 0 bottom
U$14  [LOGO-REV]  7,106.5 0 bottom
U$15  [LOGO-SN]  26.5,37 0 bottom
X1  6.25,51.5 90 top

### Tracks (layer width: path | path; a pad name or v marks a point on that pad's centre or on a via)
12V  (via drill 0.25)
  Top 0.25: U5.8 18.5,38.81 17.81,39.5 C31.2 16.31,38.25 15.5,37.44 15.5,31.75 15.25,31.5 15.25,24 v15.5,23.75 | v16,6.25 16,5.5 15.7,5.2 C52.A 11.95,5.2 11.31,4.56 L5.2
  Bottom 0.25: v15.5,23.75 16,23.25 v16,6.25
12V-IN
  Top 0.25: D11.A 3.1,7.1 3.92,7.92 H8.10 H8.9
-12V
  Top 0.25: C45.C R44.2 | U5.4 13.1,34.09 C37.1 14.75,32.44 14.75,24 14,23.25 C45.C | L2.2 11.31,21.44 11.95,20.8 C45.C
-12V-IN
  Top 0.25: H8.1 H8.2 3.92,18.08 3.1,18.9 D10.C
A3V3  (via drill 0.25)
  Top 0.25: U8.5 30.85,14.6 32.3,16.05 C46.A 32.75,18 34.25,19.5 34.25,22 36.5,24.25 C44.A 36.5,25.75 C41.2 33.06,26.81 33.25,27 33.25,27.57 | 33.25,27.57 33.25,29.4 32.45,30.2 32.45,31.55 33.02,32.12 U6.8 36.17,32.12 36.35,32.3 36.35,34.4 35.5,35.25 C34.2 33.06,42.94 31.94,44.06 C27.2 C24.2 31.19,48.75 U4.24 29.75,50.25 | U6.1 33.25,27.57 | U1.4 21.5,105.75 20.81,105.06 C5.2 20.81,98.75 | U2.4 20.81,98.75 | 20.81,98.75 C10.2 v22,95.25 | H4.4 6.69,47 10.75,47 15.81,52.06 C21.2 C22.2 20.94,52.06 21.25,51.75 U4.9 v25.5,51.75 28.75,51.75 29.75,50.75 29.75,50.25 | U4.25 29.75,50.25 | v28.75,85.25 27.65,86.35 24.4,86.35 21.5,89.25 21,89.25 v20.75,89
  Bottom 0.25: v25.5,51.75 25.5,52.75 26.5,53.75 26.5,56.63 29.25,59.38 29.25,77.14 28.75,77.64 v28.75,85.25 | v22,95.25 22,90.25 v20.75,89
ADC-FM  (via drill 0.25)
  Top 0.25: U2.1 24.14,96.8 C9.2 R22.2 v26.5,95.25 | U4.22 28.75,50 v29,50.25 | v29.75,89.5 29.5,89.75 26.75,89.75 v26.25,89.25
  Bottom 0.25: v26.5,95.25 26.5,89.5 v26.25,89.25 | v29,50.25 29,50.54 29.18,50.72 29.18,51.32 28,52.5 28,56.01 30.75,58.76 30.75,77.76 30.25,78.26 30.25,84.41 30.4,84.57 30.4,86.72 30.1,87.02 30.1,87.98 30.25,88.13 30.25,89 v29.75,89.5
ADC-GATE  (via drill 0.25)
  Top 0.25: U2.14 15.86,96.8 C8.2 R21.2 v13.5,95.25 | U4.21 28.25,50.75 v28.5,51 | v29.25,87 28.9,87.35 24.91,87.35 23.88,88.38 22.03,90.25 18.92,90.25 18.77,90.1 18.23,90.1 18.08,90.25 v16.75,90.25
  Bottom 0.25: v28.5,51 28.5,51.29 27.5,52.29 27.5,56.21 30.25,58.96 30.25,77.55 29.75,78.05 29.75,84.62 29.9,84.77 29.9,86.35 v29.25,87 | v13.5,95.25 13.75,95 13.75,93.54 16.1,91.19 16.1,90.98 16.75,90.33 v16.75,90.25
ADC-HARMO  (via drill 0.25)
  Top 0.25: U1.7 24.14,107.7 C2.2 R4.2 v26.5,109.25 | U4.28 32.85,51.75 34,50.6 v34,50.25 | v32.75,90.75 31.17,90.75 31.02,90.6 30.48,90.6 30.33,90.75 25.5,90.75 v24.75,90
  Bottom 0.25: v26.5,109.25 26.5,103.21 25.82,102.53 25.82,101.97 26,101.79 26,96.42 25.32,95.74 25.32,94.76 25.5,94.58 25.5,90.75 v24.75,90 | v34,50.25 34,51.54 31.82,53.72 31.82,56.28 33.25,57.71 33.25,78.79 32.75,79.29 32.75,83.38 32.9,83.53 32.9,88.77 32.75,88.92 v32.75,90.75
ADC-MODEL  (via drill 0.25)
  Top 0.25: U2.7 24.14,100.7 C7.2 | R16.2 C7.2 | v24.75,102.25 C7.2 | U4.19 27.25,50 v27,50.25 | v24.75,91 25,91.25 v30.75,91.25
  Bottom 0.25: v24.75,102.25 25.5,101.5 25.5,96.62 24.82,95.94 24.82,94.56 25,94.38 25,91.25 v24.75,91 | v27,50.25 28.04,50.25 28.72,49.57 29.28,49.57 29.68,49.97 29.68,51.53 28.5,52.71 28.5,55.8 31.25,58.55 31.25,77.96 30.75,78.46 30.75,84.21 30.9,84.36 30.9,86.93 30.6,87.23 30.6,87.77 30.75,87.92 v30.75,91.25
ADC-MORPH  (via drill 0.25)
  Top 0.25: U1.14 15.86,103.8 C3.2 R9.2 v13.5,102.25 | U4.27 32.5,51.25 33.25,50.5 v33.25,49.75 | v16.75,91.25 18.08,91.25 18.23,91.4 18.77,91.4 18.92,91.25 22.5,91.25 25.4,88.35 30.23,88.35 30.73,88.85 31.9,88.85 v32.25,88.5
  Bottom 0.25: v13.5,102.25 13.5,96.21 14.25,95.46 14.25,93.75 v16.75,91.25 | v33.25,49.75 33.25,51.59 31.32,53.51 31.32,56.49 32.75,57.91 32.75,78.58 32.25,79.08 32.25,83.58 32.4,83.74 32.4,88.13 32.25,88.28 v32.25,88.5
ADC-TIMBRE  (via drill 0.25)
  Top 0.25: U1.8 15.86,107.7 C1.2 R3.2 v13.5,109.25 | U4.20 27.75,50.75 v27.5,51 | v29.25,86 28.4,86.85 24.65,86.85 21.75,89.75 19.5,89.75 v19,89.25
  Bottom 0.25: v13.5,109.25 13.5,103.21 14.18,102.53 14.18,101.97 14,101.79 14,96.42 14.75,95.67 14.75,94.17 17.4,91.52 17.4,91.14 17.85,90.69 17.85,90.4 v19,89.25 | v27.5,51 27.5,51.59 27,52.09 27,56.42 29.75,59.17 29.75,77.34 29.25,77.84 29.25,84.83 29.4,84.98 29.4,85.85 v29.25,86
ADC-TRIG  (via drill 0.25)
  Top 0.25: C6.2 R15.2 | U2.8 15.86,100.7 C6.2 | v15.25,102.25 C6.2 | U4.18 26.75,47.75 v27,47.5 | v31.25,87.5 30.9,87.85 25.15,87.85 22.25,90.75 v18.5,90.75
  Bottom 0.25: v15.25,102.25 14.5,101.5 14.5,96.62 15.25,95.87 15.25,94.38 17.9,91.73 17.9,91.35 v18.5,90.75 | v27,47.5 28.57,49.07 29.49,49.07 30.18,49.76 30.18,51.77 29,52.95 29,55.59 31.75,58.34 31.75,78.17 31.25,78.67 31.25,84 31.4,84.15 31.4,87.35 v31.25,87.5
ADC-VOCT  (via drill 0.25)
  Top 0.25: U1.1 24.14,103.8 C4.2 R10.2 v26.5,102.25 | v32.5,50.25 32.23,50.52 32.23,50.53 32.01,50.75 U4.26 | v25.75,90 26,90.25 30.12,90.25 30.37,90 v31.75,90
  Bottom 0.25: v25.75,90 26,90.25 26,94.79 25.82,94.97 25.82,95.53 26.5,96.21 v26.5,102.25 | v32.5,50.25 32.5,51.63 30.82,53.3 30.82,56.7 32.25,58.12 32.25,78.38 31.75,78.88 31.75,83.79 31.9,83.94 31.9,87.93 31.6,88.23 31.6,88.77 31.75,88.92 v31.75,90
AREF-N10  (via drill 0.25)
  Top 0.25: C48.2 R44.1 20.89,19.19 U7.2 21.05,21.8 22.5,23.25 22.5,40.75 v25,43.25 | R8.1 v11.75,102.25 R14.1 | R11.1 v28.25,102.25 R17.1 | R23.1 v28.25,95.25 | R5.1 v28.25,109.25 27.5,110 12.5,110 v11.75,109.25 R2.1 | R20.1 v11.75,95.25 | v35.65,52 35.65,51.81 37.25,50.21 37.25,46.9 v37.4,46.75
  Bottom 0.25: v11.75,95.25 v11.75,102.25 v11.75,109.25 | v28.25,95.25 v28.25,102.25 v28.25,109.25 29,110 35,110 37.75,107.25 37.75,82.1 35.25,79.6 35.25,52.4 v35.65,52 | v25,43.25 33.9,43.25 v37.4,46.75
AUX-JACK
  Top 0.25: R43.2 12.06,31.6 13.4,30.26 13.4,29.25 12.08,27.93 H5.9
D3V3  (via drill 0.25)
  Top 0.25: U9.3 37.3,5.5 C50.A 36.81,13.49 C47.2 36.75,16.81 v36.75,18.25 | v33.75,24 33.56,23.81 C43.2 29.61,23.81 C42.A 29.38,23.58 U6.20 30.43,27.57 30.6,27.75 30.6,29.52 | 30.6,29.52 30.6,33.25 30.43,33.42 U6.11 29.38,40.62 27.69,42.31 C28.2 C26.2 26.75,46.5 26.25,47 U4.17 v26.25,51 | U6.17 30.6,29.52 | C17.2 C18.2 22.81,57.25 U4.48 24.25,55.75 | U4.1 24.25,55.75 | 24.25,55.75 24.25,55.25 26.25,53.25 v26.25,52.5 | C17.2 22.06,61.44 21,62.5 15.6,62.5 14.75,63.35 14.75,64.9 | v4.5,79.5 L1.1 | v24.5,59.75 C17.2 | v27.5,64 27.75,64.25 32.54,64.25 32.88,63.91 33.59,63.91 35,62.5 | v14.75,65.5 14.75,64.9 | D9.2 14.75,64.9 | 35,62.5 R33.2 | v37,62.5 35,62.5
  Bottom 0.25: v36.75,18.25 36.75,21 v33.75,24 | v26.25,52.5 v26.25,51 | v4.5,79.5 4.5,79.1 8.25,75.35 8.25,74.18 7,72.93 H2.5 7,67.25 9,65.25 14.5,65.25 v14.75,65.5 | v27.5,64 25.75,62.25 25.75,61 v24.5,59.75 | v37,62.5 35.75,61.25 35.75,54.33 H7.1
DAC-BCK  (via drill 0.25)
  Top 0.25: U6.13 27.88,32.12 27.5,32.5 27.5,37.25 v27.75,37.5 | v35.5,37.5 35.5,38.5 35.75,38.75 35.75,49.59 33.09,52.25 U4.29
  Bottom 0.25: v27.75,37.5 28,37.75 35.25,37.75 v35.5,37.5
DAC-DIN  (via drill 0.25)
  Top 0.25: U6.14 27.77,31.48 27,32.25 v27,38.25 | U4.31 32.21,53.25 32.63,52.82 33.22,52.82 36.25,49.79 v36.25,38.25
  Bottom 0.25: v27,38.25 v36.25,38.25
DAC-LRCK  (via drill 0.25)
  Top 0.25: U6.15 27.68,30.82 26.5,32 26.5,37.75 26.25,38 v26.25,39 | U4.32 32.41,53.75 32.84,53.32 33.43,53.32 36.75,50 36.75,39.25 v37,39
  Bottom 0.25: v26.25,39 27.25,39 27.5,38.75 35.79,38.75 36.04,39 v37,39
FM-JACK  (via drill 0.25)
  Top 0.25: R24.1 D8.2 32.69,96.19 v32.75,96.25 | H4.1 0.5,43.65 0.5,55.25 1.2,55.95 2.45,55.95 3.2,56.7 3.2,60.3 1,62.5 1,67.75 v2.5,69.25 | v1.75,84 3.71,85.95 4.99,85.95 5.75,86.72 5.75,90.35 7.47,92.08 11.12,92.08 11.79,92.75 15.91,92.75 16.07,92.9 19.39,92.9 19.54,92.75 29.91,92.75 30.07,92.9 31.43,92.9 31.59,92.75 32.25,92.75 v32.5,93
  Bottom 0.25: v2.5,69.25 4.21,70.95 4.99,70.95 5.73,71.7 5.73,75.32 5,76.05 3.21,76.05 1.5,77.75 1.5,83.75 v1.75,84 | v32.75,96.25 32.75,93.25 v32.5,93
FM-SHUNT  (via drill 0.25)
  Top 0.25: R29.2 v5.75,64
  Bottom 0.25: v5.75,64 5.75,62.9 3.2,60.35 3.2,56.69 5.25,54.64 5.25,47.64 5.73,47.16 5.73,44.2 7,42.93 H4.5
FREQ-ATT  (via drill 0.25)
  Top 0.25: H4.10 12.1,44.75 16.25,44.75 16.94,44.06 C29.2 18.03,44.09 21.09,44.09 24,47 v24,47.25 | U4.15 25.25,47.5 v25.5,47.25
  Bottom 0.25: v24,47.25 v25.5,47.25
FREQ-POT  (via drill 0.25)
  Top 0.25: H3.8 11.19,61.42 C14.2 | U4.10 24.5,51.25 v24.75,51
  Bottom 0.25: v24.75,51 24.5,51.25 23.75,51.25 13.96,61.05 11.55,61.05 10.28,59.77 H3.8
GND  (via drill 0.25)
  other vias: 36.5,109.75 38.5,109 39.25,106.75 39.25,103.75 39.25,100.5 39.25,97.25 39.25,94 39.25,90.5 39.25,87 39.25,83.5 39.25,80 30.85,107.5 30.85,105.75 29.1,105.75 29.1,107.5 30.85,104 30.85,102.25 30.85,100.5 30.85,98.75 29.1,104 29.1,102.25 29.1,100.5 29.1,98.75 30.85,97 29.1,97 27.35,97 24.05,98.75 27.35,100.5 27.35,102.25 27.35,104 27.35,105.75 27.35,107.5 27.3,109.25 25.6,107.5 25.6,105.75 25.6,104 29.2,109.25 30.85,109.25 25.6,109.25 30.85,95.25 29.1,95.25 27.35,95.25 14.35,107.5 14.35,105.75 14.35,104 12.6,105.75 12.6,107.5 12.7,109.25 14.35,109.25 10.85,107.5 10.85,109.25 9.1,107.5 9.1,105.75 10.85,105.75 10.85,104 9.1,104 9.1,102.25 10.85,102.25 10.85,100.5 9.1,100.5 12.6,100.5 12.6,102.25 12.6,104 16,98.75 10.85,98.75 9.1,109.25 7.35,107.4 7.35,105.75 7.35,104 7.35,102.25 9.1,97 7.35,97 7.35,98.75 9.1,95.25 12.6,97 12.6,95.25 24,105.75 15.95,105.75 21.75,106.5 21.75,105 18.25,105.75 18.25,106.5 18.25,105 27.35,98.75 12.6,98.75 18.25,98.75 18.25,99.5 18.25,98 21.75,99.5 21.75,98 22.75,102.25 17.25,102.25 19.75,103.75 19.75,100.75 19.75,96.75 17.25,95.25 23.5,95 23,109 20,108.25 17,109 31.85,93.75 29.1,93.5 32.75,109.25 34.5,109 33.75,104.75 36.75,106.75 36.75,101.75 34.75,99 36.75,97.25 35.25,94.25 36.75,92 7.25,109.25 3.25,109.75 1.5,109 0.75,107.25 5.25,107.5 3.5,105.75 2.75,103.5 0.75,101.5 0.75,104.5 5.25,104.5 5.25,102.25 3.5,101.75 1.75,99.5 4.35,99.5 4.1,97.25 1.25,95.75 4,95.25 4.25,92.25 7.25,94 10.25,93.5 2.25,94 1.25,91.25 5.25,109.75 10.75,88.5 13.5,88.25 15,90.75 16.25,89.5 18.35,88.6 19.75,88.25 21.5,87.25 23,85.5 23.75,91 25.45,89.25 1.15,85.85 1.2,88.5 34.5,90.5 33.75,88.75 36.75,88.25 37,84.5 36.1,81.7 33.75,82.25 34.25,86 26,85.25 26.25,81.75 22.25,82 19,81.75 16.25,82 14,80 13,78.25 12,82.25 12,79.75 8.5,79.75 10.25,77.75 6.5,79.5 8.25,81.5 7.25,78 7.5,83.5 5.5,81.5 5.5,83.5 2.75,82.25 2.75,79.25 5,77 14,82 24.25,83.5 26.25,78.75 22.25,78.75 37,78.75 39.25,76.5 39.25,73 39.25,68.75 36.75,68.5 36.75,73.25 36.75,75.5 26.75,76 23.5,61.75 18,63.75 16.75,70.75 26,66.5 8.5,68.5 13.5,68.5 14,66.25 26.5,71 21.75,75.25 19.5,72.75 24.75,73.75 22.75,70.75 23.25,65 6,68.5 3.5,68.5 1.25,70.75 1.2,73.5 13.5,74 10.75,73.5 8.25,71.25 3.15,66 4.9,66 6.65,66 3.15,64 3.15,61.5 1.65,63 6.65,64 4.9,64.25 6.65,62.5 4.3,62.6 10.15,66.05 14,62.25 12.75,63.5 10.25,63.5 9.95,61.2 15.5,61.05 21.25,58.9 21.25,60.65 19.5,58.9 19.5,60.65 17.5,61.75 17.75,60 23,58.9 36.75,66 36.75,63.5 39.25,66 39.25,63.5 39.25,61.75 28.25,61.5 24.25,54 24.5,58.65 15.75,57.25 10.75,58.5 13.4,58.65 6.45,55.9 30.75,47.75 28.5,45.65 30.25,45.65 28.5,47.5 28.5,43.95 26.75,45.65 26.75,43.95 8.75,55.5 10.5,55.5 13.25,54.75 11.25,53 8.5,51 12.5,51.5 11.25,49 8.75,49.5 1.25,54.75 3.5,53.5 3.75,52 2.25,51.5 1.25,52.75 1.25,49.5 3.5,49.5 3.5,47.5 1.5,47.25 8.75,47.75 12.25,47 14.75,52.25 18.9,51.25 18.75,49.25 16.75,51 20.8,50.9 20.5,49.25 16.75,49.25 19.75,47.25 14.9,49.75 16.65,46.75 14.9,46.25 22.25,49.25 21.5,45.75 17.05,44.9 23,47.25 19.05,44.9 18.5,41.25 16.75,42.25 21,42.25 22.75,43 25.25,46 24.25,44.5 15,43.25 21.45,54.55 13.5,39.5 14.5,38 17,37.75 15,41 19.75,40.25 14.5,34.5 16.5,34.25 20.5,34.25 21.5,36.25 21.5,39 26.5,42.25 28.25,40 23.75,40.25 25.25,38.25 23.5,34.25 25.5,34.25 23.5,36.75 29,42.25 32.15,42.15 30.25,39.75 32.25,39.75 33.25,44.75 34.7,42.2 34.5,39.75 39.25,47.25 37.75,45.5 39.25,43.75 37.75,41.75 39.25,39.5 34.5,36.5 38,34.75 37.25,37.5 39.25,36.5 39.25,32.5 39.25,30.5 39.25,28.5 39.25,26.5 36.55,31.45 35.25,34.25 33.5,33.5 31.5,34 30.25,35.25 31.5,36.75 28.5,36.75 28.5,34.25 2.5,40.25 0.75,41 0.75,38 0.75,36 2.6,38 4.35,38 2.65,35.65 2.65,34 7.9,34 5.75,40 7.5,40.75 8.75,36.1 9.75,37.95 11.2,38.75 10.95,34.7 2.5,31.5 0.75,31.25 11.5,31.25 13.5,31.75 16.25,31.25 17.5,31.75 23.5,31.75 21.5,31.75 5.75,28.5 0.75,28.5 0.75,25.75 7,25.25 12,25.25 13.75,28 12.5,21.75 13.75,24.5 10.25,21.75 8.5,21.75 7,19.75 4.25,19.5 5,21.5 10.5,24.25 7.25,23.25 3,23.25 0.75,23 0.75,20.25 0.75,17.75 14.9,23.15 17,21.75 19.95,20 20,22.25 21.5,23.75 16.5,24.5 16.25,26.75 16.25,29 19.5,31.75 21.5,29.25 21.5,26.25 19,28.75 19,25.25 5,24.75 3,25.25 9.25,25.25 25.5,31.75 27.75,30 25.5,30 25.5,27.5 24,28.75 27.75,27.5 28.5,25 25.75,25 25.75,22 23.5,23.5 23.5,26.25 22.25,21 24.25,19.25 23.25,17.75 26.5,18 28.75,19.5 28.75,16.5 31,22 32.25,21 33.5,22.75 33.25,19.75 28.25,22 26.5,20.25 31,19.5 31.5,16.5 24,21.5 20.5,17.75 20.5,15.75 19,13.75 17.5,15.75 17.25,19.75 17.25,17.75 26,16.5 26,13.5 27.75,15 24.25,15 29.75,14.25 22.75,15.75 22.75,13.25 20.75,13 20.75,10.5 19.25,10.25 17,9.75 17,11.75 17,14 36.7,28.8 36.5,26.75 34,26.75 31.5,31.75 31.2,24.6 30.25,25.75 31.75,27 32,29.25 34.75,24.75 38,24.5 35,21.25 35.25,18.5 38,21.25 38,17.75 39.25,19.5 39.25,23 35.25,15.5 33.75,16.25 33.75,14.5 31.75,14.25 33.75,11.5 31.75,12.25 29.9,12.25 35.5,11.75 29.75,10.25 35.5,14.25 32,10.25 23,10.75 24,7.75 21,8 22.5,8 23.25,6.25 25,4.75 27,10.75 25,10.75 26.25,8 30,5.25 28.5,6.75 36.5,9.75 36.5,7.25 35.5,5.25 34.5,9 28.25,9 31,8 33.5,6.75 14,18 12.5,15.25 12.5,13 12.5,10.75 12.5,8.75 12.5,17.5 15.25,13 15.35,20.1 15.35,15.2 15.35,10.8 15.3,8.75 15.3,17.45 9.75,19.25 12.5,20 10,8 10.75,11.5 10.75,14 10.75,16.5 0.75,15 0.75,12.25 0.75,9.25 0.75,6.5 0.75,3.5 3.5,0.75 1.5,1.5 4.25,6.75 2.75,8.75 2.75,17.75 2.75,15 2.75,12.75 8.75,4.25 7,6.25 5,4.5 3.5,3 7,3 6,0.75 9,0.75 10.5,2 11.75,0.75 10.5,4 12,6.5 15.25,7.25 17.25,7.25 16,4 12.25,4.25 14,2.75 14.5,0.75 17,0.75 19.75,0.75 22.25,0.75 24.75,0.75 27.5,0.75 30.25,0.75 32.75,0.75 35,0.75 37,0.75 39.25,3 38.5,1.5 39.25,5 39.25,7.5 39.25,10 39.25,12.75 39.25,16 16,2.25 23.5,3.5 26.5,3.5 25,2.25 26.75,5.75 28.5,3.75 37,3.75 37.5,14.5 38,11.5 39.4,59 34.55,54.85 34.55,54.35 37,61.25 39.4,56.65 34.75,47 38.25,49 39.25,50.5 38,52.5 36.5,52 37,51.5 37.5,52 34,49.25 34.5,49.5 35,49.25 34.55,55.35 34.55,55.85 34.55,53.85 38.5,60.5
  pour Top (isolate 0.25): 0,110.5 40,110.5 40,0 0,0
  pour Bottom (isolate 0.25): 0,110.5 40,110.5 40,0 0,0
HARMO-JACK  (via drill 0.25)
  Top 0.25: R6.1 D2.2 32.69,108.31 v32.75,108.25 | H2.2 1,75.69 1,82.25 4.21,85.45 5.2,85.45 5.7,85.95 7.53,85.95 8.27,86.7 8.27,90.32 8.7,90.75 8.71,90.75 9.01,91.05 11.51,91.05 12.21,91.75 16.33,91.75 16.48,91.9 17.02,91.9 17.17,91.75 17.87,91.75 18.02,91.9 18.98,91.9 19.13,91.75 30.33,91.75 30.48,91.9 31.02,91.9 31.17,91.75 v34.25,91.75
  Bottom 0.25: v32.75,108.25 32.75,104.21 33.43,103.53 33.43,102.32 33.93,101.82 33.93,100.76 33.75,100.58 33.75,97.62 34.43,96.94 34.43,95.56 34.25,95.38 34.25,93.25 34.75,92.75 34.75,92.25 v34.25,91.75
HARMO-POT  (via drill 0.25)
  Top 0.25: H3.10 12.41,59.44 C16.2 | U4.12 23.75,50.25 v24,50.5
  Bottom 0.25: H3.10 12.83,60.52 13.73,60.52 23.75,50.5 v24,50.5
IREF
  Top 0.25: U3.23 14.89,84.89 15,85 R25.2
JTCK/SWCLK
  Top 0.25: H7.4 37.88,54.83 38.71,55.66 38.71,59.25 37.52,60.44 35.9,60.44 35.62,60.72 32.63,60.72 32.35,60.44 28.19,60.44 27.75,60 27.75,59 28.25,58.5 29.5,58.5 29.75,58.25 U4.37
JTDI  (via drill 0.25)
  Top 0.25: U4.38 29.25,55.25 v29.65,54.85
  Bottom 0.25: H7.8 37.88,57.17 39.21,55.84 39.21,51.81 35.42,48.02 33.13,48.02 31.37,49.78 31.37,51.29 29.5,53.16 29.5,54.7 v29.65,54.85
JTDO/SWO  (via drill 0.25)
  Top 0.25: U4.39 28.75,54.8 v30.15,53.4
  Bottom 0.25: H7.6 37.88,55.9 38.71,55.07 38.71,52.02 35.22,48.52 33.34,48.52 31.87,49.99 31.87,51.53 30.15,53.25 v30.15,53.4
JTMS/SWDIO
  Top 0.25: U4.34 33.39,54.75 33.88,54.26 33.88,53.58 34.82,52.63 37.22,52.63 37.88,53.3 H7.2
LED1G  (via drill 0.25)
  Top 0.25: v16.8,88 U3.20
  Bottom 0.25: H1.8 10.82,91.05 12.7,91.05 15.75,88 v16.8,88
LED1R  (via drill 0.25)
  Top 0.25: v17.43,88.75 U3.19
  Bottom 0.25: H1.6 7.7,89.77 9.48,91.55 12.95,91.55 16,88.5 16.34,88.5 16.59,88.75 v17.43,88.75
LED2G  (via drill 0.25)
  Top 0.25: v18.07,87 U3.18
  Bottom 0.25: H1.9 12.31,87 16.13,87 16.31,86.82 17.64,86.82 17.82,87 v18.07,87
LED2R  (via drill 0.25)
  Top 0.25: v18.7,87.75 U3.17
  Bottom 0.25: v18.7,87.75 17.86,87.75 17.43,87.32 16.52,87.32 16.34,87.5 15.54,87.5 13.27,89.77 H1.10
LED3G  (via drill 0.25)
  Top 0.25: v19.34,86 U3.16
  Bottom 0.25: v19.34,86 19.09,86 18.91,85.82 15.9,85.82 15.72,86 13.41,86 12.86,85.45 8.78,85.45 H1.5
LED3R  (via drill 0.25)
  Top 0.25: v19.97,86.75 U3.15
  Bottom 0.25: H1.7 10.82,85.95 12.65,85.95 13.2,86.5 15.93,86.5 16.1,86.32 18.7,86.32 19.13,86.75 v19.97,86.75
LED4G  (via drill 0.25)
  Top 0.25: v20.61,85 U3.14
  Bottom 0.25: H1.1 4.7,84.45 13.27,84.45 13.82,85 15.3,85 15.48,84.82 20.18,84.82 20.36,85 v20.61,85
LED4R  (via drill 0.25)
  Top 0.25: v21.24,85.75 U3.13
  Bottom 0.25: H1.3 6.74,84.95 13.06,84.95 13.61,85.5 15.51,85.5 15.69,85.32 19.97,85.32 20.4,85.75 v21.24,85.75
LED5G
  Top 0.25: H2.6 8.78,76.55 12.81,76.55 13.36,76 16.46,76 17.43,76.97 U3.6
LED5R
  Top 0.25: H2.4 6.74,77.05 13.02,77.05 13.57,76.5 16.25,76.5 16.8,77.05 U3.5
LED6G
  Top 0.25: H2.10 12.31,75 16.87,75 18.7,76.83 U3.8
LED6R
  Top 0.25: H2.8 10.82,76.05 12.55,76.05 12.61,76.05 13.15,75.5 16.66,75.5 18.07,76.9 U3.7
LED7G
  Top 0.25: H2.7 10.82,70.95 12.25,70.95 12.26,70.95 12.61,70.95 15.65,74 17.29,74 19.97,76.69 U3.10
LED7R
  Top 0.25: H2.9 13.18,72.23 15.45,74.5 17.08,74.5 19.34,76.76 U3.9
LED8G
  Top 0.25: H2.1 4.2,69.95 13.05,69.95 16.1,73 17.7,73 21.24,76.54 U3.12
LED8R
  Top 0.25: H2.3 6.24,70.45 12.81,70.45 15.86,73.5 17.49,73.5 20.61,76.61 U3.11
LEDS-SCK  (via drill 0.25)
  Top 0.25: U4.33 33,54.25 v33.25,54 | v35,80.25 16.29,80.25 15.53,79.48 U3.3
  Bottom 0.25: v35,80.25 34.75,80 34.75,57.04 33.88,56.17 33.88,55.24 33.25,54.61 v33.25,54
LEDS-SIN  (via drill 0.25)
  Top 0.25: U4.35 33,55.25 v33.25,55.5 | v34.25,81 34,80.75 16.09,80.75 14.89,79.56 U3.2
  Bottom 0.25: v34.25,81 34.25,57.25 33.25,56.25 v33.25,55.5
LEDS-SS  (via drill 0.25)
  Top 0.25: U4.36 32.25,55.75 v32.5,56 | U3.4 16.16,79.41 16.5,79.75 33.25,79.75 v33.5,79.5
  Bottom 0.25: v33.5,79.5 33.75,79.25 33.75,57.5 32.5,56.25 v32.5,56
LEVEL-JACK  (via drill 0.25)
  Top 0.25: R19.1 D7.2 7.31,96.19 v7.25,96.25
  Bottom 0.25: H5.2 2.7,30.55 2.7,30.56 3.46,31.32 3.46,41.39 3.2,41.65 3.2,45.3 4.75,46.85 4.75,54.43 3.23,55.95 1.39,55.95 0.5,56.85 0.5,93.5 3.25,96.25 v7.25,96.25
LEVEL-SHUNT  (via drill 0.25)
  Top 0.25: R30.2 v7.5,64
  Bottom 0.25: v7.5,64 7.5,62.1 5.75,60.35 5.75,47.85 8.25,45.35 8.25,39.75 4.46,35.96 H5.4
MODEL-JACK  (via drill 0.25)
  Top 0.25: R18.1 D6.2 32.69,101.31 v32.75,101.25 | v21,56.5 21,56.25 19.5,54.75 17,54.75 16.5,55.25 16,55.25 v15.25,54.5 | v33.5,90 32.67,90 32.02,89.35 30.52,89.35 30.02,88.85 29.48,88.85 29.08,89.25 27.5,89.25 v27.25,89
  Bottom 0.25: v32.75,101.25 32.75,97.21 33.43,96.53 33.43,95.97 33.25,95.79 33.25,91.17 33.4,91.02 33.4,90.1 v33.5,90 | H5.5 7,27.93 8.25,29.18 8.25,30.35 5.5,33.1 5.5,35.5 10.96,40.95 12.61,40.95 13.4,41.75 13.4,52.65 v15.25,54.5 | v21,56.5 22.5,56.5 23.82,57.82 23.82,60.03 25.25,61.46 25.25,62.75 27.75,65.25 27.75,76.51 27.25,77.01 27.25,84.35 27.1,84.5 27.1,85.93 27.25,86.09 v27.25,89
MORPH-ATT
  Top 0.25: H4.9 12.08,42.97 13.36,44.25 16.04,44.25 17.06,43.23 19.67,43.23 C30.2 21.06,43.31 24.75,47 U4.14
MORPH-JACK
  Top 0.25: R7.1 D3.2 3.69,103.19 0.5,100 0.5,58.65 H3.1
MORPH-POT
  Top 0.25: H4.8 10.27,44.77 11.55,46.05 12.7,46.05 13.5,45.25 16.25,45.25 16.69,45.69 C25.2 20.19,45.69 21.25,46.75 21.25,50.25 21.75,50.75 U4.11
MORPH-SHUNT
  Top 0.25: R28.2 4,64 5.75,62.25 5.75,58.48 H3.5
N$1
  Top 0.25: C20.2 4.44,54.31 X1.3 5.05,52.45 5.5,52 9.31,52 R34.1
N$2
  Top 0.25: C23.2 3.19,51 7,51 7.45,50.55 X1.1 8.06,48.69 R35.1
N$16
  Top 0.25: U4.5 12,53.75 11.44,54.31 R34.2
N$17
  Top 0.25: U4.6 12.94,53.25 R35.2
N$24
  Top 0.25: U1.2 24.39,104.45 C4.1 R10.1 R11.2 R12.2
N$26
  Top 0.25: U1.6 24.39,107.05 C2.1 R4.1 R5.2 R6.2
N$30
  Top 0.25: L1.2 C11.2 7.75,82.31 8.74,83.3 C12.A 12.3,83.3 12.63,83.63 U3.24
N$31
  Top 0.25: U2.2 24.39,97.45 C9.1 R22.1 R23.2 R24.2
N$32
  Top 0.25: R1.2 R2.2 R3.1 C1.1 15.61,107.05 U1.9
N$33
  Top 0.25: U1.13 15.61,104.45 C3.1 R9.1 R8.2 R7.2
N$37
  Top 0.25: U2.6 24.39,100.05 C7.1 R16.1 R17.2 R18.2
N$42
  Top 0.25: R37.2 C32.2 R38.1
N$43
  Top 0.25: U2.9 15.61,100.05 C6.1 R15.1 R14.2 R13.2
N$44
  Top 0.25: R40.2 C35.2 R41.1
N$45
  Top 0.25: R19.2 R20.2 R21.1 C8.1 15.61,97.45 U2.13
N$47
  Top 0.25: R38.2 R39.1 C33.1 10.31,37.19 10.87,36.63 U5.2
N$48  (via drill 0.25)
  Top 0.25: R41.2 R42.1 C36.1 9.44,35.5 v10.25,35.5 | U5.6 16.86,35.37 v16.75,35.25
  Bottom 0.25: v16.75,35.25 16.5,35.5 v10.25,35.5
N$51
  Top 0.25: U6.2 36.27,28.23 37,27.5 C40.2
N$52
  Top 0.25: C40.1 37.98,29.52 U6.4
N$53  (via drill 0.25)
  Top 0.25: U6.6 34.08,30.82 v33.5,30.25 | R37.1 2.54,36.4 7.35,36.4 v7.75,36
  Bottom 0.25: v7.75,36 9.5,34.25 9.5,33.72 9.97,33.25 32.5,33.25 34,31.75 34,30.75 v33.5,30.25
N$54  (via drill 0.25)
  Top 0.25: U6.7 33.48,31.48 v33.25,31.25 | v9.25,32 8.85,32.4 1.14,32.4 0.91,32.63 0.91,33.97 R40.1
  Bottom 0.25: v9.25,32 10,32.75 32.25,32.75 33.25,31.75 v33.25,31.25
N$55
  Top 0.25: U6.5 36.42,30.18 37.75,31.5 C38.1
N$56
  Top 0.25: D10.A 8.4,23 L2.1
N$57
  Top 0.25: D11.C 8.4,3 L5.1 9.69,6.19 11.5,8 16.25,8 16.96,8.71 C51.2 19.71,8.71 20.5,9.5 L4.1 22,11.94 L3.1
N$58  (via drill 0.25)
  Top 0.25: R42.2 C36.2 9.44,33.19 v10.25,34 10.44,33.81 R43.1 | U5.7 16.86,36.63 v16.75,36.75
  Bottom 0.25: v16.75,36.75 16,36 11,36 10.75,36.25 9.95,36.25 9.5,35.8 9.5,35 10.25,34.25 v10.25,34
N$59
  Top 0.25: R39.2 C33.2 9.94,38.81 10.85,37.91 U5.1 12.5,38.5 12.06,38.94 R36.1
N$61
  Top 0.25: U9.1 27.09,6.54 C53.2 25,8.25 24,9.25 L4.2
N$62
  Top 0.25: L3.2 C49.2 27.5,12 | U8.1 27.7,13.2 27.5,13 27.5,12 | U8.3 27.7,11.3 27.5,11.5 27.5,12
N$63
  Top 0.25: U6.18 27.18,28.88 C39.2
NORM-PROBE  (via drill 0.25)
  Top 0.25: R27.1 R28.1 R29.1 R30.1 R31.1 10.56,66.81 10.85,67.1 D9.3 15.15,67.1 16,66.25 v16,64 | U4.30 27.5,52.75 25.25,55 v25.25,55.25
  Bottom 0.25: v25.25,55.25 20.46,55.25 16.2,59.51 16.2,63.8 v16,64
OUT-JACK  (via drill 0.25)
  Top 0.25: R36.2 9.69,39.75 9.54,39.6 7.4,39.6 v7,40
  Bottom 0.25: v7,40 7,39.25 3.96,36.21 3.96,31.11 3.2,30.35 3.2,29.2 1.92,27.92 H5.1
RESET  (via drill 0.25)
  Top 0.25: U4.7 24.5,52.75 v24.75,53 | H7.10 37.88,59.37 37.31,59.94 R33.1 C15.2 28.69,59.94 v28.5,59.75
  Bottom 0.25: v28.5,59.75 28.5,59.34 26,56.84 26,53.96 25.04,53 v24.75,53
RX
  Top 0.25: R26.1 35.75,66.5 36.52,67.27 H6.1
RX1
  Top 0.25: U4.46 25.25,63.46 27.04,65.25 32.19,65.25 R26.2
SW1  (via drill 0.25)
  Top 0.25: U4.43 26.75,61.25 v27,61.5 | v28.25,93.5 28,93.25 19.75,93.25 19.6,93.4 15.86,93.4 15.71,93.25 11.59,93.25 10.91,92.58 7.26,92.58 H1.4
  Bottom 0.25: v27,61.5 28.75,63.25 28.75,76.93 28.25,77.43 28.25,84.83 28.1,84.98 28.1,85.52 28.25,85.67 28.25,88.35 28.4,88.5 28.4,89.48 27.5,90.38 27.5,92.75 v28.25,93.5
SW2  (via drill 0.25)
  Top 0.25: v27.5,60.75 27.25,60.5 U4.42
  Bottom 0.25: v27.5,60.75 26.85,60.1 26.85,58.65 23.95,55.75 20.7,55.75 16.7,59.75 16.7,64.3 16.25,64.75 9,64.75 8.5,64.25 8.5,61.75 7,60.25 H3.6
TIMBRE-ATT  (via drill 0.25)
  Top 0.25: H3.7 8.25,58.52 8.25,60.35 7.94,60.66 C13.2 | U4.16 25.75,50.25 v25.5,50.5
  Bottom 0.25: v25.5,50.5 25.5,49.75 25,49.25 23.5,49.25 16.8,55.95 11.55,55.95 10.28,57.23 H3.7
TIMBRE-JACK  (via drill 0.25)
  Top 0.25: R1.1 D1.2 7.31,108.31 v7.25,108.25 | v1.5,85 3.2,86.7 3.2,99.95 v4.5,101.25
  Bottom 0.25: H3.2 1,60.69 1,69.5 3.19,71.69 3.19,75.31 1,77.5 1,84.5 v1.5,85 | v7.25,108.25 4.5,105.5 v4.5,101.25
TIMBRE-POT  (via drill 0.25)
  Top 0.25: H3.9 12.66,57.81 C19.2 | U4.13 24.25,49.75 24.5,50 v24.75,50
  Bottom 0.25: v24.75,50 24.5,49.75 23.75,49.75 17.02,56.48 12.83,56.48 H3.9
TIMBRE-SHUNT
  Top 0.25: R27.2 2.25,63.5 4.46,61.29 H3.4
TRIG-JACK  (via drill 0.25)
  Top 0.25: R13.1 D5.2 7.31,101.31 v7.25,101.25 | v16.25,54.5 16.5,54.25 19.75,54.25 22,56.5 v23.5,56.5 | v27.5,94 27.25,93.75 19.96,93.75 19.81,93.9 15.65,93.9 15.5,93.75 11.25,93.75 v10.5,94.5
  Bottom 0.25: H5.8 6,33.31 6,35.24 11.21,40.45 12.81,40.45 13.9,41.54 13.9,52.4 15.25,53.75 15.5,53.75 v16.25,54.5 | v23.5,56.5 v23.5,56.51 26.32,59.33 26.32,61.78 28.25,63.71 28.25,76.72 27.75,77.22 27.75,84.62 27.6,84.77 27.6,85.73 27.75,85.88 27.75,88.58 27.9,88.73 27.9,89.27 27,90.17 27,93.5 v27.5,94 | v7.25,101.25 10.5,98 v10.5,94.5
TRIG-SHUNT  (via drill 0.25)
  Top 0.25: R31.2 v9.25,64 | H5.10 10.53,31.32 8.97,31.32 8.39,31.9 6.15,31.9 v5.75,31.5
  Bottom 0.25: v9.25,64 9.25,61.3 8.25,60.3 8.25,56.65 6.25,54.65 6.25,48.06 8.26,46.05 10.11,46.05 10.8,45.35 10.8,41.55 5,35.75 5,32.85 5.75,32.1 v5.75,31.5
TX
  Top 0.25: R32.1 37.98,64.75 H6.2
TX1
  Top 0.25: U4.45 25.75,63.25 27.25,64.75 R32.2
VOCT-JACK  (via drill 0.25)
  Top 0.25: R12.1 D4.2 32.69,103.19 v32.75,103.25 | v34,92.5 33.75,92.25 31.38,92.25 31.23,92.4 30.27,92.4 30.12,92.25 19.34,92.25 19.18,92.4 17.82,92.4 17.66,92.25 17.38,92.25 17.23,92.4 16.27,92.4 16.12,92.25 12,92.25 11.32,91.58 8.82,91.58 8.5,91.25 v7.75,91.25
  Bottom 0.25: v32.75,103.25 32.75,102.21 33.43,101.53 33.43,100.97 33.25,100.79 33.25,97.42 33.93,96.74 33.93,95.76 33.75,95.58 33.75,92.75 v34,92.5 | H1.2 3.4,91.25 v7.75,91.25

### Text on the board
tPlace: TD-UPSE-C-MB / 2024-07-30 | RX | TX
bPlace: RX | TX | SWD/JTAG | Board derived / from work by / Émilie Gillet / of Mutable / Instruments | POWER